# Altium project Tigershark 3D rev2 PreProduction Thermistors Version.PrjPcb (part 1 of 2)
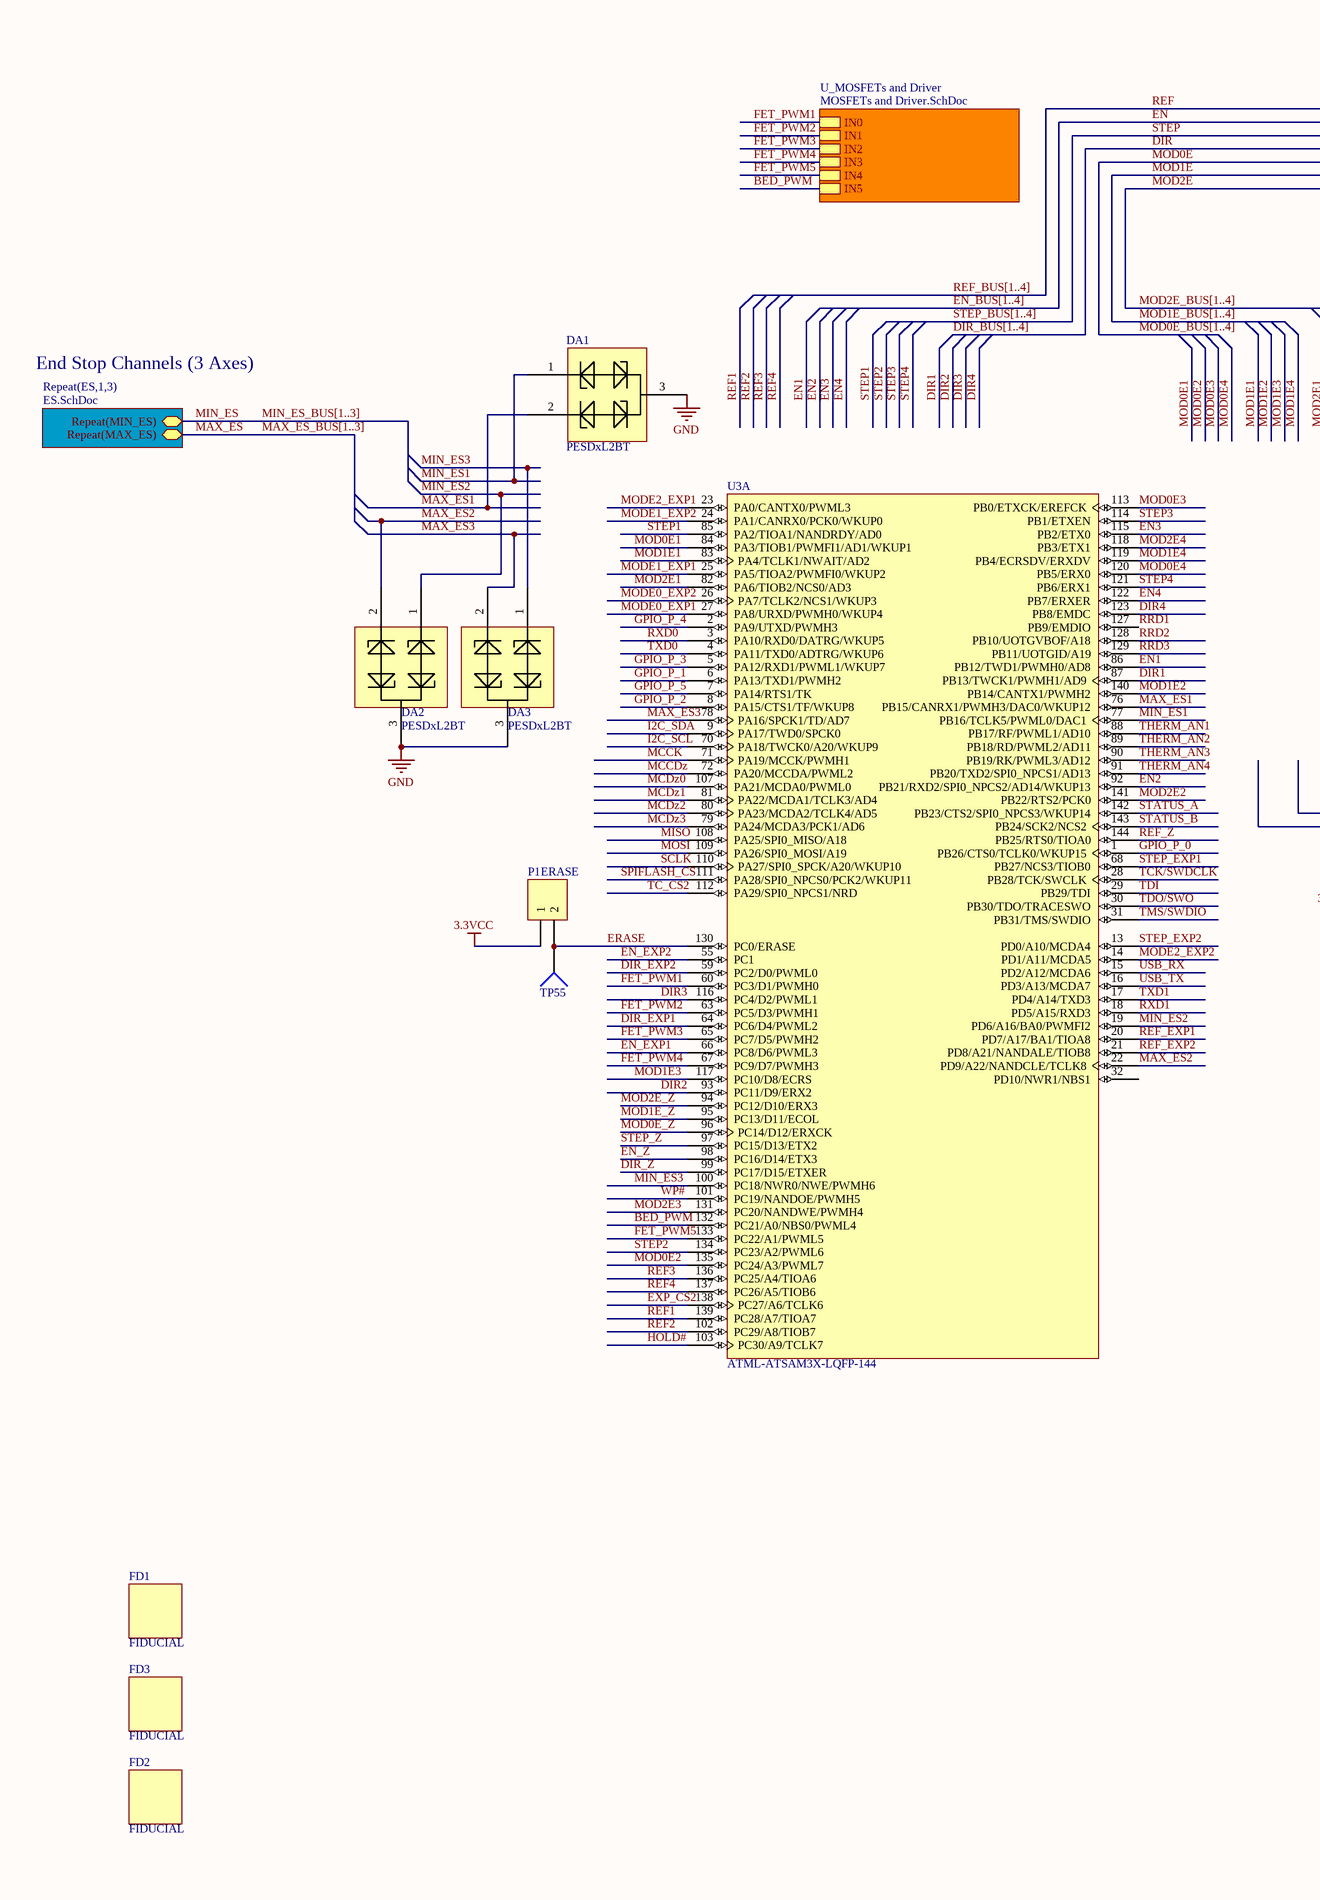
[diagram p0: ATSAM3X8E Main Controller - TR R1.1.SchDoc, left]
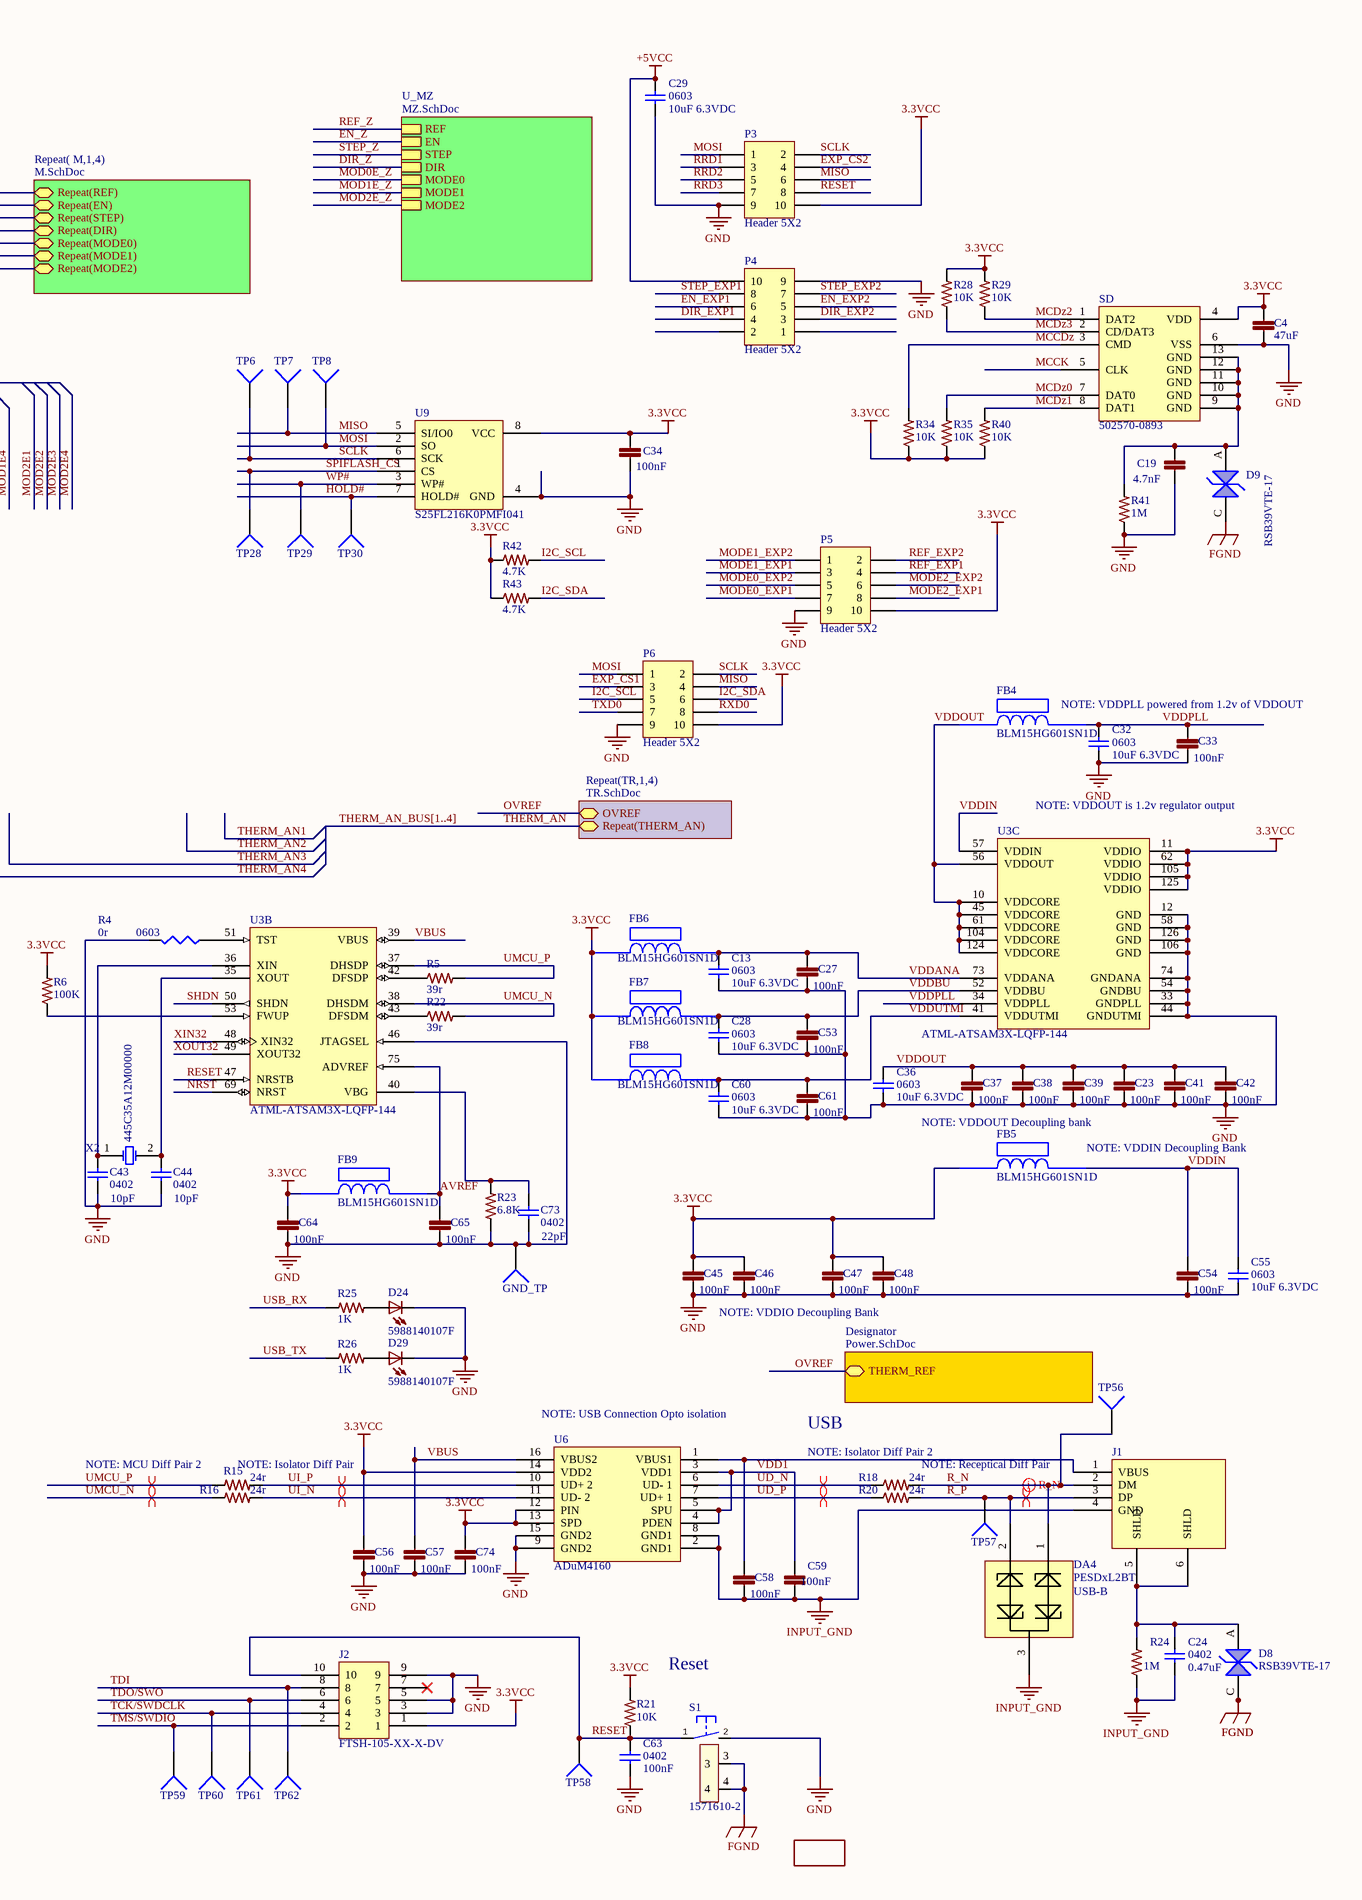
[diagram p1: ATSAM3X8E Main Controller - TR R1.1.SchDoc, right]
7 sheets, 425 parts. Net scope: hierarchical (ports join the sheet entries above them; power ports are global).
Board file: Tigershark 3D R2.4 - TR.PcbDoc
Sheets:
  ATSAM3X8E Main Controller - TR R1.1.SchDoc
    TR1 = TR.SchDoc
    TR2 = TR.SchDoc
    TR3 = TR.SchDoc
    TR4 = TR.SchDoc
    Designator = Power.SchDoc
    ES1 = ES.SchDoc
    ES2 = ES.SchDoc
    ES3 = ES.SchDoc
    M1 = M.SchDoc
    M2 = M.SchDoc
    M3 = M.SchDoc
    M4 = M.SchDoc
    U_MOSFETs and Driver = MOSFETs and Driver.SchDoc
    U_MZ = MZ.SchDoc

## Sheet ATSAM3X8E Main Controller - TR R1.1.SchDoc
size C

### Parts
C4  47uF  [C0805]
C13  0603  value 10uF 6.3VDC  [C0603]
C19  4.7nF  [C0402]
C23  100nF  [C0402]
C24  value 0.47uF  [C0402]  (hidden comment: 0402)
C27  100nF  [C0402]
C28  0603  value 10uF 6.3VDC  [C0603]
C29  0603  value 10uF 6.3VDC  [C0603]
C32  0603  value 10uF 6.3VDC  [C0603]
C33  100nF  [C0402]
C34  100nF  [C0402]
C36  0603  value 10uF 6.3VDC  [C0603]
C37  100nF  [C0402]
C38  100nF  [C0402]
C39  100nF  [C0402]
C41  100nF  [C0402]
C42  100nF  [C0402]
C43  0402  value 10pF  [C0402]
C44  0402  value 10pF  [C0402]
C45  100nF  [C0402]
C46  100nF  [C0402]
C47  100nF  [C0402]
C48  100nF  [C0402]
C53  100nF  [C0402]
C54  100nF  [C0402]
C55  0603  value 10uF 6.3VDC  [C0603]
C56  100nF  [C0402]
C57  100nF  [C0402]
C58  100nF  [C0402]
C59  100nF  [C0402]
C60  0603  value 10uF 6.3VDC  [C0603]
C61  100nF  [C0402]
C63  value 100nF  [C0402]  (hidden comment: 0402)
C64  100nF  [C0402]
C65  100nF  [C0402]
C73  0402  value 22pF  [C0402]
C74  100nF  [C0402]
D8  RSB39VTE-17  [SOD323-R]
D9  RSB39VTE-17  [SOD323-R]
D24  5988140107F  [LED2012120]
D29  5988140107F  [LED2012120]
DA1  PESDxL2BT  [SOT95P230X110-3N]
DA2  PESDxL2BT  [SOT95P230X110-3N]
DA3  PESDxL2BT  [SOT95P230X110-3N]
DA4  PESDxL2BT  [SOT95P230X110-3N]
FB4  BLM15HG601SN1D  [BLM18PG121SN1D]
FB5  BLM15HG601SN1D  [BLM18PG121SN1D]
FB6  BLM15HG601SN1D  [BLM18PG121SN1D]
FB7  BLM15HG601SN1D  [BLM18PG121SN1D]
FB8  BLM15HG601SN1D  [BLM18PG121SN1D]
FB9  BLM15HG601SN1D  [BLM18PG121SN1D]
FD1  FIDUCIAL  [FIDUCIAL-1X2]
FD2  FIDUCIAL  [FIDUCIAL-1X2]
FD3  FIDUCIAL  [FIDUCIAL-1X2]
GND_TP  TP4  [TP-2]  (value not drawn)
J1  USB-B  [PN61729]
J2  FTSH-105-XX-X-DV  [FTSH-105-XX-X-DV]
LOGO1  OSHW_LOGO_8MILX0150-NT  [OSHW_8X150_NOTEXT]  (value not drawn)
P1  ERASE  [HDR1X2]
P3  Header 5X2  [HDR2X5]
P4  Header 5X2  [HDR2X5]
P5  Header 5X2  [HDR2X5]
P6  Header 5X2  [HDR2X5]
R4  0603  value 0r  [J1-0603]
R5  39r  [R0402]
R6  100K  [R0603]
R15  24r  [R0603]
R16  24r  [R0603]
R18  24r  [R0603]
R20  24r  [R0603]
R21  10K  [R0603]
R22  39r  [R0402]
R23  6.8K  [R0402]
R24  1M  [R0402]
R25  1K  [R0603]
R26  1K  [R0603]
R28  10K  [R0603]
R29  10K  [R0603]
R34  10K  [R0603]
R35  10K  [R0603]
R40  10K  [R0603]
R41  1M  [R0402]
R42  4.7K  [R0603]
R43  4.7K  [R0603]
S1  1571610-2  [B3F-31XX]
SD  502570-0893  [502570-0893 - Molex SD]
TP6  TP4  [TP-2]  (value not drawn)
TP7  TP4  [TP-2]  (value not drawn)
TP8  TP4  [TP-2]  (value not drawn)
TP28  TP4  [TP-2]  (value not drawn)
TP29  TP4  [TP-2]  (value not drawn)
TP30  TP4  [TP-2]  (value not drawn)
TP55  TP4  [TP-2]  (value not drawn)
TP56  TP4  [TP-2]  (value not drawn)
TP57  TP4  [TP-2]  (value not drawn)
TP58  TP4  [TP-2]  (value not drawn)
TP59  TP4  [TP-2]  (value not drawn)
TP60  TP4  [TP-2]  (value not drawn)
TP61  TP4  [TP-2]  (value not drawn)
TP62  TP4  [TP-2]  (value not drawn)
U3  ATML-ATSAM3X-LQFP-144  [LQFP144_N]  (parts A,B,C of 3)
U6  ADuM4160  [ADuM4160]
U9  S25FL216K0PMFI041  [S25FL216K0PMFI041]
X2  445C35A12M00000  [445C35A12M00000]

### Sub-sheets
Designator = Power.SchDoc: THERM_REF
Repeat( M,1,4) = M.SchDoc: Repeat(REF), Repeat(EN), Repeat(STEP), Repeat(DIR), Repeat(MODE0), Repeat(MODE1), Repeat(MODE2)
Repeat(ES,1,3) = ES.SchDoc: Repeat(MAX_ES), Repeat(MIN_ES)
Repeat(TR,1,4) = TR.SchDoc: OVREF, Repeat(THERM_AN)
U_MOSFETs and Driver = MOSFETs and Driver.SchDoc: IN0, IN1, IN2, IN3, IN4, IN5
U_MZ = MZ.SchDoc: REF, EN, STEP, DIR, MODE0, MODE1, MODE2

### Nets
3.3VCC: C4.1 C34.1 C45.1 C46.1 C47.1 C48.1 C56.1 C64.1 C74.1 FB5.1 FB6.1 FB7.1 FB8.1 FB9.1 J2.1 P1.1 P3.10 P5.10 P6.10 R6.2 R21.2 R28.2 R29.2 R34.1 R35.1 R40.1 R42.1 R43.1 SD.4(VDD) U3.11(VDDIO) U3.62(VDDIO) U3.105(VDDIO) U3.125(VDDIO) U6.12(PIN) U6.13(SPD) U6.14(VDD2) U9.8(VCC)
+5VCC: C29.2 P4.10
FGND: D8.C D9.C S1.3 S1.4
GND: C4.2 C13.1 C19.2 C23.2 C27.2 C28.1 C29.1 C32.1 C33.2 C34.2 C36.1 C37.2 C38.2 C39.2 C41.2 C42.2 C43.1 C44.1 C45.2 C46.2 C47.2 C48.2 C53.2 C54.2 C55.1 C56.2 C57.2 C60.1 C61.2 C63.1 C64.2 C65.2 C73.1 C74.2 D24.C D29.C DA1.3 DA2.3 DA3.3 GND_TP.1 J2.3 J2.5 J2.9 P3.9 P4.9 P5.9 P6.9 R4.2 R23.1 R41.1 S1.2(S) SD.6(VSS) U3.12(GND) U3.33(GNDPLL) U3.44(GNDUTMI) U3.46(JTAGSEL) U3.54(GNDBU) U3.58(GND) U3.74(GNDANA) U3.106(GND) U3.126(GND) U6.9(GND2) U6.15(GND2) U9.4(GND)
INPUT_GND: C24.1 C58.2 C59.2 DA4.3 J1.4(GND) R24.1 U6.2(GND1) U6.8(GND1)
AVREF: C65.1 FB9.2 U3.75(ADVREF)
BED_PWM: U3.132(PC21/A0/NBS0/PWML4) ; sheet U_MOSFETs and Driver/IN5
DIR: sheet Repeat( M,1,4)/Repeat(DIR)
DIR1: U3.87(PB13/TWCK1/PWMH1/AD9)
DIR2: U3.93(PC11/D9/ERX2)
DIR3: U3.116(PC4/D2/PWML1)
DIR4: U3.123(PB8/EMDC)
DIR_EXP1: P4.4 U3.64(PC6/D4/PWML2)
DIR_EXP2: P4.3 U3.59(PC2/D0/PWML0)
DIR_Z: U3.99(PC17/D15/ETXER) ; sheet U_MZ/DIR
EN: sheet Repeat( M,1,4)/Repeat(EN)
EN1: U3.86(PB12/TWD1/PWMH0/AD8)
EN2: U3.92(PB21/RXD2/SPI0_NPCS2/AD14/WKUP13)
EN3: U3.115(PB2/ETX0)
EN4: U3.122(PB7/ERXER)
EN_EXP1: P4.6 U3.66(PC8/D6/PWML3)
EN_EXP2: P4.5 U3.55(PC1)
EN_Z: U3.98(PC16/D14/ETX3) ; sheet U_MZ/EN
ERASE: P1.2 TP55.1 U3.130(PC0/ERASE)
EXP_CS1: P6.3
EXP_CS2: P3.4 U3.138(PC27/A6/TCLK6)
FET_PWM1: U3.60(PC3/D1/PWMH0) ; sheet U_MOSFETs and Driver/IN0
FET_PWM2: U3.63(PC5/D3/PWMH1) ; sheet U_MOSFETs and Driver/IN1
FET_PWM3: U3.65(PC7/D5/PWMH2) ; sheet U_MOSFETs and Driver/IN2
FET_PWM4: U3.67(PC9/D7/PWMH3) ; sheet U_MOSFETs and Driver/IN3
FET_PWM5: U3.133(PC22/A1/PWML5) ; sheet U_MOSFETs and Driver/IN4
GPIO_P_0: U3.1(PB26/CTS0/TCLK0/WKUP15)
GPIO_P_1: U3.6(PA13/TXD1/PWMH2)
GPIO_P_2: U3.8(PA15/CTS1/TF/WKUP8)
GPIO_P_3: U3.5(PA12/RXD1/PWML1/WKUP7)
GPIO_P_4: U3.2(PA9/UTXD/PWMH3)
GPIO_P_5: U3.7(PA14/RTS1/TK)
HOLD#: TP30.1 U3.103(PC30/A9/TCLK7) U9.7(HOLD#)
I2C_SCL: P6.5 R42.2 U3.70(PA18/TWCK0/A20/WKUP9)
I2C_SDA: P6.6 R43.2 U3.9(PA17/TWD0/SPCK0)
MAX_ES: sheet Repeat(ES,1,3)/Repeat(MAX_ES)
MAX_ES1: DA1.2 U3.76(PB15/CANRX1/PWMH3/DAC0/WKUP12)
MAX_ES2: DA2.2 U3.22(PD9/A22/NANDCLE/TCLK8)
MAX_ES3: DA3.2 U3.78(PA16/SPCK1/TD/AD7)
MCCDz: R34.2 SD.3(CMD) U3.72(PA20/MCCDA/PWML2)
MCCK: SD.5(CLK) U3.71(PA19/MCCK/PWMH1)
MCDz0: R35.2 SD.7(DAT0) U3.107(PA21/MCDA0/PWML0)
MCDz1: R40.2 SD.8(DAT1) U3.81(PA22/MCDA1/TCLK3/AD4)
MCDz2: R29.1 SD.1(DAT2) U3.80(PA23/MCDA2/TCLK4/AD5)
MCDz3: R28.1 SD.2(CD/DAT3) U3.79(PA24/MCDA3/PCK1/AD6)
MIN_ES: sheet Repeat(ES,1,3)/Repeat(MIN_ES)
MIN_ES1: DA1.1 U3.77(PB16/TCLK5/PWML0/DAC1)
MIN_ES2: DA2.1 U3.19(PD6/A16/BA0/PWMFI2)
MIN_ES3: DA3.1 U3.100(PC18/NWR0/NWE/PWMH6)
MISO: P3.6 P6.4 TP7.1 U3.108(PA25/SPI0_MISO/A18) U9.5(SI/IO0)
MOD0E: sheet Repeat( M,1,4)/Repeat(MODE0)
MOD0E1: U3.84(PA3/TIOB1/PWMFI1/AD1/WKUP1)
MOD0E2: U3.135(PC24/A3/PWML7)
MOD0E3: U3.113(PB0/ETXCK/EREFCK)
MOD0E4: U3.120(PB5/ERX0)
MOD0E_Z: U3.96(PC14/D12/ERXCK) ; sheet U_MZ/MODE0
MOD1E: sheet Repeat( M,1,4)/Repeat(MODE1)
MOD1E1: U3.83(PA4/TCLK1/NWAIT/AD2)
MOD1E2: U3.140(PB14/CANTX1/PWMH2)
MOD1E3: U3.117(PC10/D8/ECRS)
MOD1E4: U3.119(PB4/ECRSDV/ERXDV)
MOD1E_Z: U3.95(PC13/D11/ECOL) ; sheet U_MZ/MODE1
MOD2E: sheet Repeat( M,1,4)/Repeat(MODE2)
MOD2E1: U3.82(PA6/TIOB2/NCS0/AD3)
MOD2E2: U3.141(PB22/RTS2/PCK0)
MOD2E3: U3.131(PC20/NANDWE/PWMH4)
MOD2E4: U3.118(PB3/ETX1)
MOD2E_Z: U3.94(PC12/D10/ERX3) ; sheet U_MZ/MODE2
MODE0_EXP1: P5.7 U3.27(PA8/URXD/PWMH0/WKUP4)
MODE0_EXP2: P5.5 U3.26(PA7/TCLK2/NCS1/WKUP3)
MODE1_EXP1: P5.3 U3.25(PA5/TIOA2/PWMFI0/WKUP2)
MODE1_EXP2: P5.1 U3.24(PA1/CANRX0/PCK0/WKUP0)
MODE2_EXP1: P5.8 U3.23(PA0/CANTX0/PWML3)
MODE2_EXP2: P5.6 U3.14(PD1/A11/MCDA5)
MOSI: P3.1 P6.1 TP8.1 U3.109(PA26/SPI0_MOSI/A19) U9.2(SO)
NRST: U3.69(NRST)
OVREF: sheet Repeat(TR,1,4)/OVREF, sheet Designator/THERM_REF
R_N: DA4.1 J1.2(DM) R18.2 TP56.1
R_P: DA4.2 J1.3(DP) R20.2 TP57.1
REF: sheet Repeat( M,1,4)/Repeat(REF)
REF1: U3.139(PC28/A7/TIOA7)
REF2: U3.102(PC29/A8/TIOB7)
REF3: U3.136(PC25/A4/TIOA6)
REF4: U3.137(PC26/A5/TIOB6)
REF_EXP1: P5.4 U3.20(PD7/A17/BA1/TIOA8)
REF_EXP2: P5.2 U3.21(PD8/A21/NANDALE/TIOB8)
REF_Z: U3.144(PB25/RTS0/TIOA0) ; sheet U_MZ/REF
RESET: C63.2 J2.10 P3.8 R21.1 S1.1(P) TP58.1 U3.47(NRSTB)
RRD1: P3.3 U3.127(PB9/EMDIO)
RRD2: P3.5 U3.128(PB10/UOTGVBOF/A18)
RRD3: P3.7 U3.129(PB11/UOTGID/A19)
RXD0: P6.8 U3.3(PA10/RXD0/DATRG/WKUP5)
RXD1: U3.18(PD5/A15/RXD3)
SCLK: P3.2 P6.2 TP6.1 U3.110(PA27/SPI0_SPCK/A20/WKUP10) U9.6(SCK)
SHDN: U3.50(SHDN)
SPIFLASH_CS: TP28.1 U3.111(PA28/SPI0_NPCS0/PCK2/WKUP11) U9.1(CS)
STATUS_A: U3.142(PB23/CTS2/SPI0_NPCS3/WKUP14)
STATUS_B: U3.143(PB24/SCK2/NCS2)
STEP: sheet Repeat( M,1,4)/Repeat(STEP)
STEP1: U3.85(PA2/TIOA1/NANDRDY/AD0)
STEP2: U3.134(PC23/A2/PWML6)
STEP3: U3.114(PB1/ETXEN)
STEP4: U3.121(PB6/ERX1)
STEP_EXP1: P4.8 U3.68(PB27/NCS3/TIOB0)
STEP_EXP2: P4.7 U3.13(PD0/A10/MCDA4)
STEP_Z: U3.97(PC15/D13/ETX2) ; sheet U_MZ/STEP
TC_CS2: U3.112(PA29/SPI0_NPCS1/NRD)
TCK/SWDCLK: J2.4 TP60.1 U3.28(PB28/TCK/SWCLK)
TDI: J2.8 TP62.1 U3.29(PB29/TDI)
TDO/SWO: J2.6 TP61.1 U3.30(PB30/TDO/TRACESWO)
THERM_AN: sheet Repeat(TR,1,4)/Repeat(THERM_AN)
THERM_AN1: U3.88(PB17/RF/PWML1/AD10)
THERM_AN2: U3.89(PB18/RD/PWML2/AD11)
THERM_AN3: U3.90(PB19/RK/PWML3/AD12)
THERM_AN4: U3.91(PB20/TXD2/SPI0_NPCS1/AD13)
TMS/SWDIO: J2.2 TP59.1 U3.31(PB31/TMS/SWDIO)
TXD0: P6.7 U3.4(PA11/TXD0/ADTRG/WKUP6)
TXD1: U3.17(PD4/A14/TXD3)
UD_N: R18.1 U6.6(UD-_1)
UD_P: R20.1 U6.7(UD+_1)
UI_N: R16.2 U6.11(UD-_2)
UI_P: R15.2 U6.10(UD+_2)
UMCU_N: R16.1 R22.2 U3.38(DHSDM)
UMCU_P: R5.2 R15.1 U3.37(DHSDP)
USB_RX: R25.1 U3.15(PD2/A12/MCDA6)
USB_TX: R26.1 U3.16(PD3/A13/MCDA7)
VBUS: C57.1 U3.39(VBUS) U6.16(VBUS2)
VDD1: C59.1 U6.3(VDD1) U6.4(PDEN) U6.5(SPU)
VDDANA: C13.2 C27.1 FB6.2 U3.73(VDDANA)
VDDBU: C28.2 C53.1 FB7.2 U3.52(VDDBU)
VDDIN: C54.1 C55.2 FB5.2 U3.57(VDDIN)
VDDOUT: C23.1 C36.2 C37.1 C38.1 C39.1 C41.1 C42.1 FB4.1 U3.10(VDDCORE) U3.45(VDDCORE) U3.56(VDDOUT) U3.61(VDDCORE) U3.104(VDDCORE) U3.124(VDDCORE)
VDDPLL: C32.2 C33.1 FB4.2 U3.34(VDDPLL)
VDDUTMI: C60.2 C61.1 FB8.2 U3.41(VDDUTMI)
WP#: TP29.1 U3.101(PC19/NANDOE/PWMH5) U9.3(WP#)
XIN32: U3.48(XIN32)
XOUT32: U3.49(XOUT32)
NetC19_1: C19.1 D9.A R41.2 SD.9(GND) SD.10(GND) SD.11(GND) SD.12(GND) SD.13(GND)
NetC24_2: C24.2 D8.A J1.5(SHLD) J1.6(SHLD) R24.2
NetC43_2: C43.2 U3.36(XIN) X2.1(OSC1)
NetC44_2: C44.2 U3.35(XOUT) X2.2(OSC2)
NetC58_1: C58.1 J1.1(VBUS) U6.1(VBUS1)
NetC73_2: C73.2 R23.2 U3.40(VBG)
NetD24_A: D24.A R25.2
NetD29_A: D29.A R26.2
NetR4_1: R4.1 U3.51(TST)
NetR5_1: R5.1 U3.42(DFSDP)
NetR6_1: R6.1 U3.53(FWUP)
NetR22_1: R22.1 U3.43(DFSDM)

Not connected (* = marked no-connect by the designer): J2 7*; P4 1 2; U3 32(PD10/NWR1/NBS1)

### Buses and harness runs
bus DIR_BUS[1..4]
bus EN_BUS[1..4]
bus MAX_ES_BUS[1..3]
bus MIN_ES_BUS[1..3]
bus MOD0E_BUS[1..4]
bus MOD1E_BUS[1..4]
bus MOD2E_BUS[1..4]
bus REF_BUS[1..4]
bus STEP_BUS[1..4]
bus THERM_AN_BUS[1..4]

### Layout directives
differential pair: R_N, R_P, UD_N, UD_P, UI_N, UI_P, UMCU_N, UMCU_P

### Notes on the sheet
- End Stop Channels (3 Axes)
- NOTE: VDDPLL powered from 1.2v of VDDOUT
- NOTE: VDDOUT is 1.2v regulator output
- NOTE: VDDOUT Decoupling bank
- NOTE: VDDIN Decoupling Bank
- NOTE: VDDIO Decoupling Bank
- (near U6) NOTE: USB Connection Opto isolation
- USB
- NOTE: MCU Diff Pair 2
- (near R15) NOTE: Isolator Diff Pair
- NOTE: Isolator Diff Pair 2
- NOTE: Receptical Diff Pair
- Reset

### Library data of the parts
C4 = CL21A476MQCLRNC: CAP CER 47UF 6.3V 20% X5R 0805; Manufacturer: Samsung; LastRevisionNote: ImportComponents; Published: 10 - may 2015; Publisher: UltiMachine; LastRevisionDate: 10 may 2015; ManufacturerPartNumber: CL21A476MQCLRNC; VALUE: 47uF
C13 C28 C29 C32 C36 C55 C60 = C1608JB0J106K080AB: CAP CER 10UF 6.3V 10% JB 0603; MFR: TDK; Voltage: 6.3VDC; Published: 10 - Dec - 2014; LatestRevisionDate: 10 - Dec - 2014; Component Type: Chip Capacitor; MFR Part #: C1608JB0J106K080AB; Part Description: CAP CER 10UF 6.3V 10% JB 0603; Mounting Type: SMT 0603; Datasheet: http://www.tdk.com/pdf/TDKMLCCCapRange.pdf; Height: 0.9mm; Tolerance: 10%; Digikey #: 445-11185-1-ND; PackageReference: 0402
C19 = CC0402KRX7R8BB472: CAP CER 0402 4.7nF 25V 10% X7R; LastRevisionNote: ImportComponents; Published: 23-Apr-2014; Publisher: UltiMachine; LastRevisionDate: 23-Apr-2014; ManufacturerPartNumber: CC0402KRX7R8BB472; VALUE: 4.7nF
C23 C27 C33 C34 C37-C39 C41 C42 C45-C48 C53 C54 C56-C59 C61 C64 C65 C74 = GRM155R71C104KA88D: CAP CER 0402 100nF 16V 10% X7R; LastRevisionNote: ImportComponents; Published: 23-Apr-2014; Publisher: UltiMachine; LastRevisionDate: 23-Apr-2014; ManufacturerPartNumber: GRM155R71C104KA88D; VALUE: 100nF
C24 = GRM155R60J474KE19D: 0.47uF 6.3v C0402 - GRM155R60J474KE19D; MFR: Murata; Part Description: CAP CER 0.47UF 6.3V 10% X5R 0402; Tolerance: 10%; Voltage: 6.3VDC; Published: 10 - Dec - 2014; LatestRevisionDate: 10 - Dec - 2014; LatestRevisionNote: Ultimachine Footprint Added; Publisher: Ultimachine; Component Type: Chip Capacitor; MFR Part #: GRM155R60J474KE19D; Mounting Type: SMT 0402; Datasheet: http://search.murata.co.jp/Ceramy/image/img/A01X/G101/ENG/GRM155R60J474KE19-01.pdf; Height: 0.5 ±0.05mm; PackageReference: 0402
C43 C44 = CL05C100JB5NNNC: CAP CER 10PF 50V 5% NP0 0402; MFR: Samsung; Tolerance: 10%; Voltage: 50VDC; Published: 10 - Dec - 2014; LatestRevisionDate: 10 - Dec - 2014; LatestRevisionNote: Ultimachine Footprint Added; Publisher: Ultimachine; Component Type: Chip Capacitor; MFR Part #: CL05C100JB5NNNC; Part Description: CAP CER 10PF 50V 5% NP0 0402; Mounting Type: SMT 0402; Datasheet: http://www.samsungsem.com/kr/front/downloadcms.do?path=/kr/support/product-search/mlcc/__icsFiles/afieldfile/2014/11/05&fileName=S_CL05C100JB5NNNC.pdf; Height: 0.55mm; PackageReference: 0402
C63 = 100nF C0402 - GRM155R71C104KA88D: Capacitor (Semiconductor SIM Model); MFR: Murata; Part Description: CAP CER 0.1UF 16V 10% X7R 0402; Tolerance: 10%; Voltage: 16v; Published: 10 - Dec - 2014; LatestRevisionDate: 10 - Dec - 2014; LatestRevisionNote: Ultimachine Footprint Added; Publisher: Ultimachine; Component Type: Chip Capacitor; MFR Part #: GRM155R71C104KA88D; Mounting Type: SMT 0402; Datasheet: http://psearch.murata.com/capacitor/product/GRM155R71C104KA88%23.pdf; Height: 0.5 ±0.05mm; PackageReference: 0402
C73 = CL05C220JB5NNNC: CAP CER 22PF 50V 5% NP0 0402; MFR: Samsung; Tolerance: 10%; Voltage: 50VDC; Published: 10 - Dec - 2014; LatestRevisionDate: 10 - Dec - 2014; LatestRevisionNote: Ultimachine Footprint Added; Publisher: Ultimachine; Component Type: Chip Capacitor; MFR Part #: CL05C220JB5NNNC; Part Description: CAP CER 22PF 50V 5% NP0 0402; Mounting Type: SMT 0402; Datasheet: http://www.samsungsem.com/kr/front/downloadcms.do?path=/kr/support/product-search/mlcc/__icsFiles/afieldfile/2014/11/05&fileName=S_CL05C220JB5NNNC.pdf; Height: 0.55mm; PackageReference: 0402
D8 D9 = RSB39VTE-17: DIODE TVS
D24 D29 = 5988140107F: LED 0805 Yellow; LastRevisionNote: ImportComponents; Published: 23-Apr-2014; Publisher: UltiMachine; LastRevisionDate: 23-Apr-2014; VALUE: 5988140107F
DA1-DA4 = PESDxL2BT: PESDxL2BT TVS Diode Array 2x
GND_TP TP6-TP8 TP28-TP30 TP55-TP62 = Socket: LatestRevisionDate: 17-Jul-2002; LatestRevisionNote: Re-released for DXP Platform.; Publisher: Altium Limited
J2 = ARM Cortex JTAG-DEBUG Header
LOGO1 = OSHW_LOGO_8MILX0150-NT: LastRevisionNote: ImportComponents; Published: 23-Apr-2014; Publisher: UltiMachine; LastRevisionDate: 23-Apr-2014
P1 = Header 2: Header, 2-Pin; LatestRevisionDate: 17-Jul-2002; LatestRevisionNote: Re-released for DXP Platform.; Publisher: Altium Limited
P3-P6 = Header 5X2: Header, 5-Pin, Dual row; LatestRevisionDate: 17-Jul-2002; LatestRevisionNote: Re-released for DXP Platform.; Publisher: Altium Limited
R4 = Res3: Resistor; Published: 8-Jun-2000; LatestRevisionDate: 29-May-2009; LatestRevisionNote: IPC-7351 Footprint Added.; PackageReference: J1-0603; Publisher: Altium Limited; PackageDescription: Chip Resistor
R5 R22 = ERJ-2RKF39R0X: RES SMD 39 OHM 1% 1/10W 0402; Manufacturer: Panasonic; LastRevisionNote: ImportComponents; Published: 23-Apr-2014; Publisher: UltiMachine; LastRevisionDate: 23-Apr-2014; ManufacturerPartNumber: ERJ-2RKF39R0X; Height: 0.4mm; VALUE: 39r
R6 = RC0603FR-07100KL: RES 100K OHM 1/10W 1% 0603 SMD; LastRevisionNote: ImportComponents; Published: 23-Apr-2014; Publisher: UltiMachine; LastRevisionDate: 23-Apr-2014; ManufacturerPartNumber: RC0603FR-07100KL; VALUE: 100K
R15 R16 R18 R20 = RC1608F240CS: RES SMD 24 OHM 1% 1/10W 0603; Manufacturer: Samsung; ManufacturerPartNumber: RC0603FR-07100KL; LastRevisionNote: ImportComponents; Published: 23-Apr-2014; Publisher: UltiMachine; LastRevisionDate: 23-Apr-2014; VALUE: 24r; PDF: http://www.samsungsem.com/global/support/library/product-catalog/__icsFiles/afieldfile/2015/01/12/CHIP_RESISTOR_150112_1.pdf
R21 R28 R29 R34 R35 R40 = ERJ-3EKF1002V: RES 0603 10K 100mW 1%; LastRevisionNote: ImportComponents; Published: 23-Apr-2014; Publisher: UltiMachine; LastRevisionDate: 23-Apr-2014; ManufacturerPartNumber: ERJ-3EKF1002V; VALUE: 10K
R23 = CRCW04026K80FKED: RES SMD 6.8K OHM 1% 1/16W 0402; Manufacturer: Vishay Dale; LastRevisionNote: ImportComponents; Published: 23-Apr-2014; Publisher: UltiMachine; LastRevisionDate: 23-Apr-2014; ManufacturerPartNumber: CRCW04026K80FKED; Height: 0.4mm; VALUE: 6.8K
R24 R41 = ERJ2GEJ105X: RES 0402 1M 100mW 5%; LastRevisionNote: ImportComponents; Published: 23-Apr-2014; Publisher: UltiMachine; LastRevisionDate: 23-Apr-2014; ManufacturerPartNumber: ERJ2GEJ105X; VALUE: 1M
R25 R26 = ERJ-3EKF1001V: RES 0603 1K 100mW 1%; LastRevisionNote: ImportComponents; Published: 23-Apr-2014; Publisher: UltiMachine; LastRevisionDate: 23-Apr-2014; ManufacturerPartNumber: ERJ-3EKF1001V; VALUE: 1K
R42 R43 = ERJ3EKF4701V: RES 0603 4.7K 100mW 1%; LastRevisionNote: ImportComponents; Published: 23-Apr-2014; Publisher: UltiMachine; LastRevisionDate: 23-Apr-2014; ManufacturerPartNumber: ERJ3EKF4701V; VALUE: 4.7K
S1 = 1571610-2_1: SWTCH Momentary Washable; Manufacturer: Omron; Manufacturer: TE; LastRevisionNote: Import; ComponentLink1URL: http://www.te.com/commerce/DocumentDelivery/DDEController?Action=srchrtrv&DocNm=1571610&DocType=Customer+Drawing&DocLang=English; ComponentLink1Description: Datasheet for B3F-31XX; Published: 23-Apr-2014; Publisher: UltiMachine; LastRevisionDate: 23-Apr-2014; ManufacturerPartNumber: 1571610-2; Supplier 1: Mouser; Supplier Part Number 1: 506-1571610-2
SD = 502570-0893: microSD 502570-0893 Molex Part
U6 = ADuM4160: USB Opto Isolator
U9 = S25FL216K0PMFI041: Manufacture: Spansion; Active: Yes; Manufacture Part #: S25FL216K0PMFI041; Mounting Type: SMD; Type: SOIC; Datasheet: http://www.spansion.com/Support/Datasheets/S25FL216K_00.pdf; Digikey Part NUmber: 1274-1052-ND; Price: $0.35
X2 = XTAL: Crystal Oscillator; Published: 8-Jun-2000; LatestRevisionDate: 17-Jul-2002; LatestRevisionNote: Re-released for DXP Platform.; PackageReference: R38; Publisher: Altium Limited; PackageDescription: Crystal, Thru-Hole; 2 Leads; Body 3.1 x 8.2 mm (Dia.xH)

## Sheet TR.SchDoc
size A
Used 4 times, as channels TR1, TR2, TR3, TR4. Parts and nets are listed once, with the designators drawn on the sheet.
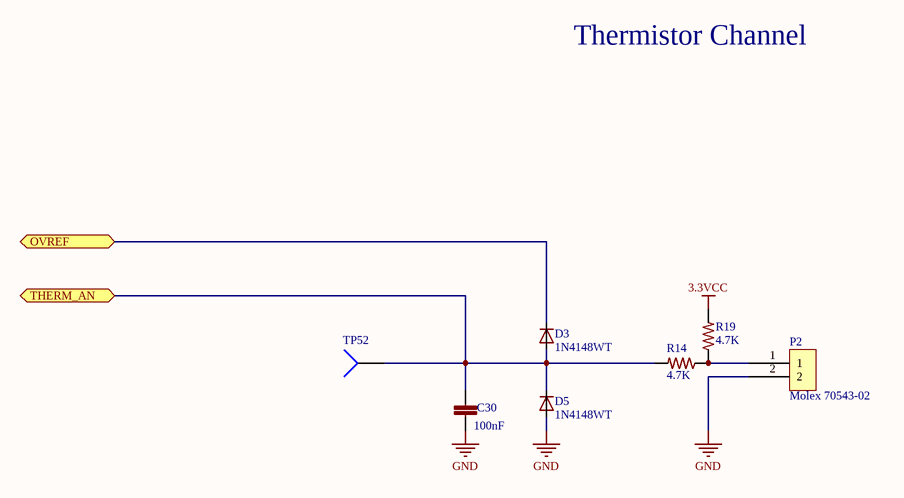
[diagram p2: TR.SchDoc]

### Parts
C30  100nF  [C0402]
D3  1N4148WT  [SOD523]
D5  1N4148WT  [SOD523]
P2  Molex 70543-02  [70543-02]
R14  4.7K  [R0603]
R19  4.7K  [R0603]
TP52  TP4  [TP-2]  (value not drawn)

### Ports
OVREF, THERM_AN

### Nets
3.3VCC: R19.2
GND: C30.2 D5.A P2.2
OVREF: D3.C ; port OVREF
THERM_AN: C30.1 D3.A D5.C R14.2 TP52.1 ; port THERM_AN
NetP2_1: P2.1 R14.1 R19.1

### Channels
TR1: designators end in _TR1; ports OVREF=OVREF THERM_AN=THERM_AN1
TR2: designators end in _TR2; ports OVREF=OVREF THERM_AN=THERM_AN2
TR3: designators end in _TR3; ports OVREF=OVREF THERM_AN=THERM_AN3
TR4: designators end in _TR4; ports OVREF=OVREF THERM_AN=THERM_AN4

### Notes on the sheet
- Thermistor Channel

### Library data of the parts
C30 = GRM155R71C104KA88D: as C23 on sheet ATSAM3X8E Main Controller - TR R1.1; Published: 23-Apr-2014; Publisher: UltiMachine; LastRevisionDate: 23-Apr-2014; ManufacturerPartNumber: GRM155R71C104KA88D; VALUE: 100nF
D3 D5 = 1N4148WT: DIODE SOD523; LastRevisionNote: ImportComponents; Published: 23-Apr-2014; Publisher: UltiMachine; LastRevisionDate: 23-Apr-2014; Value: 1N4148WT
R14 R19 = ERJ3EKF4701V: as R42 on sheet ATSAM3X8E Main Controller - TR R1.1; Published: 23-Apr-2014; Publisher: UltiMachine; LastRevisionDate: 23-Apr-2014; ManufacturerPartNumber: ERJ3EKF4701V; VALUE: 4.7K
TP52 = Socket: LatestRevisionDate: 17-Jul-2002; LatestRevisionNote: Re-released for DXP Platform.; Publisher: Altium Limited

## Sheet Power.SchDoc
size B
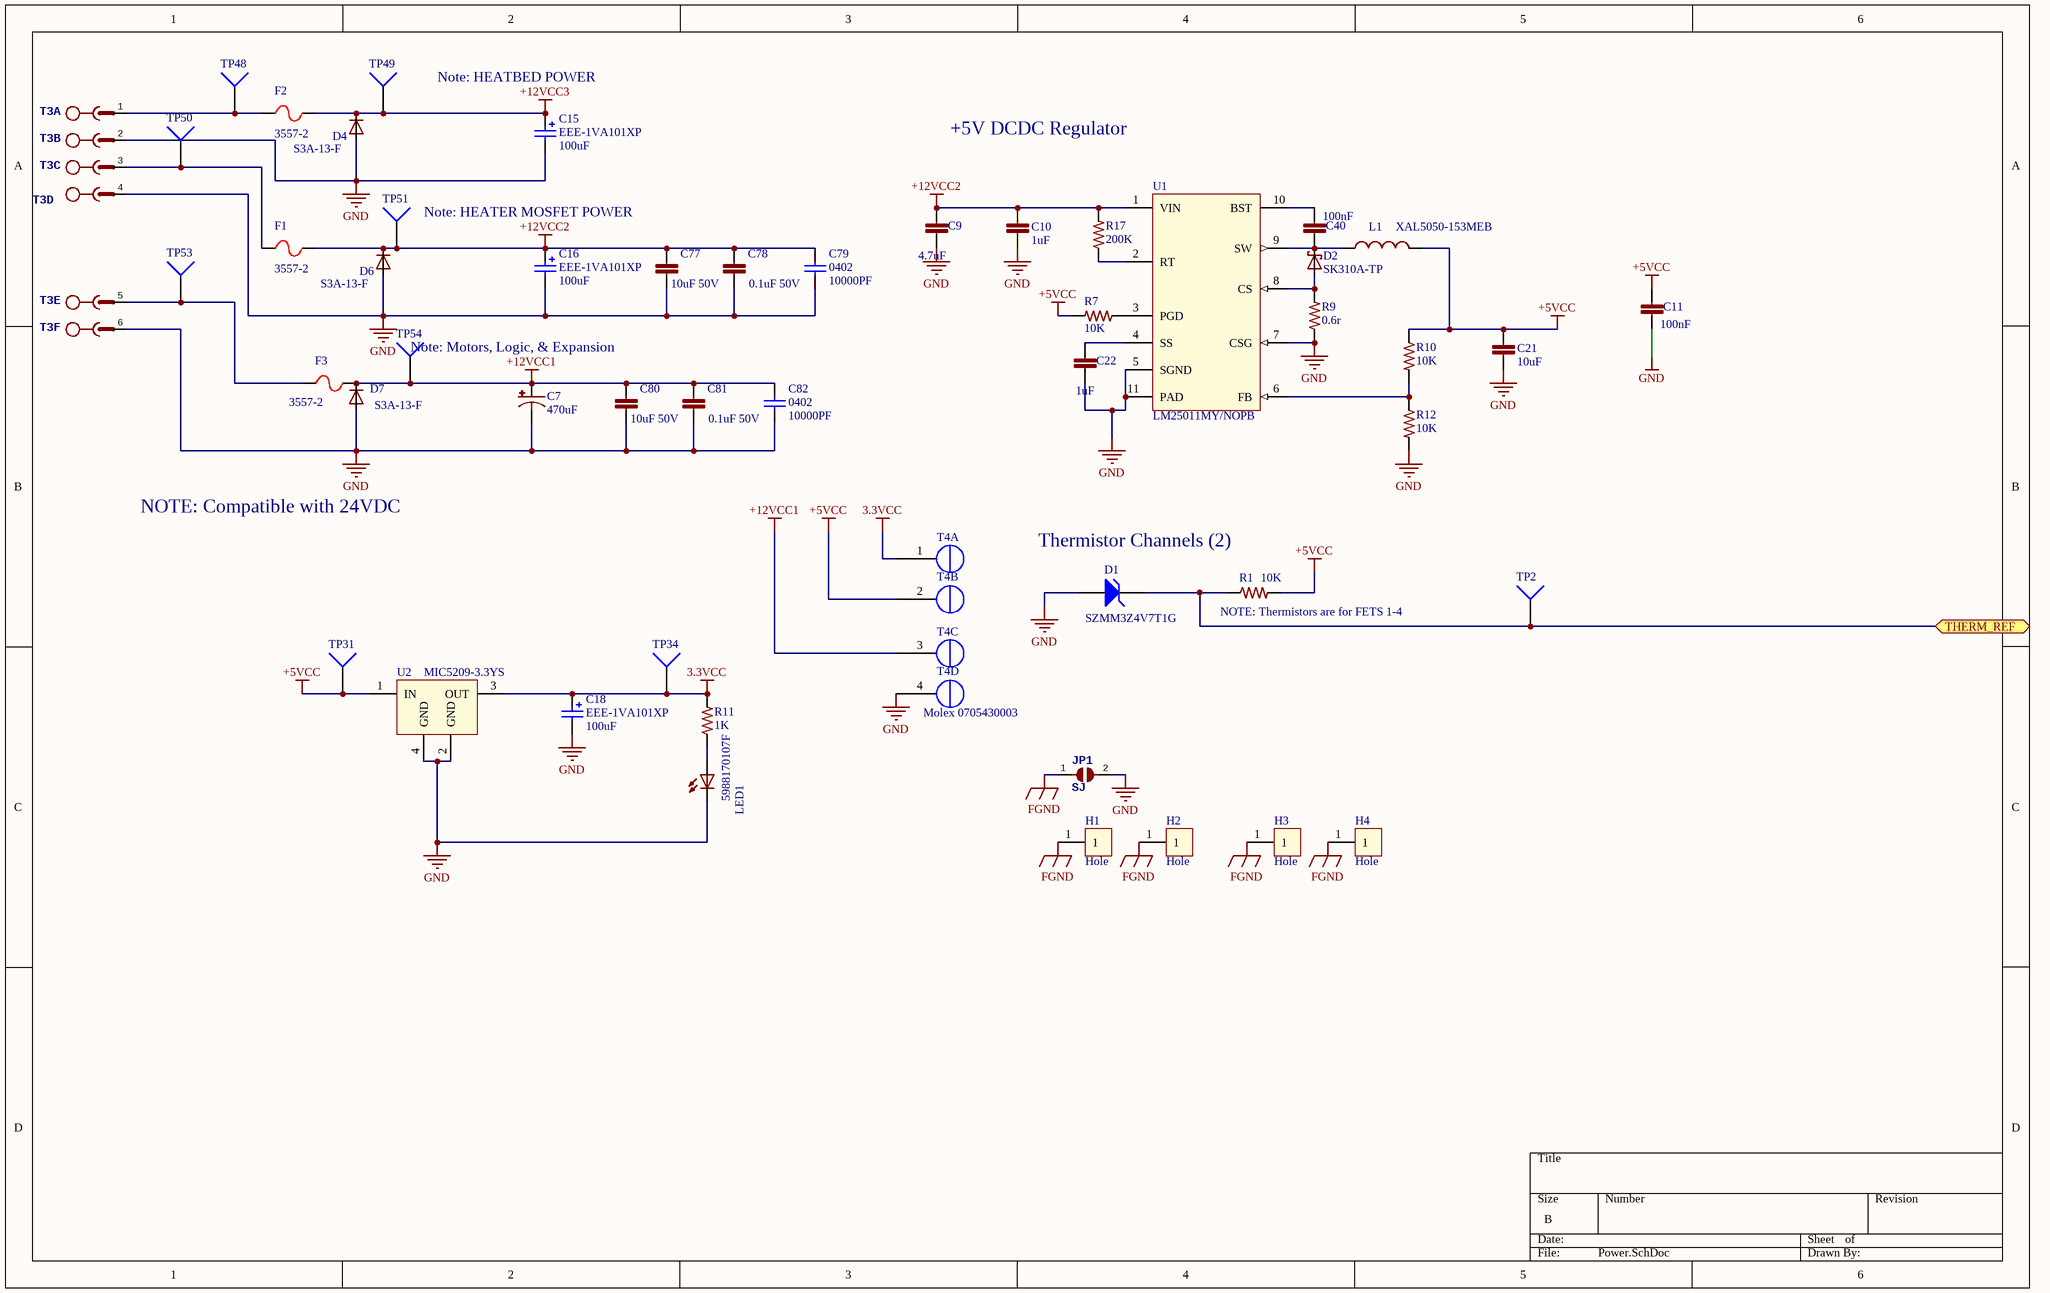
[diagram p3: Power.SchDoc]

### Parts
C7  470uF  [C12,5-5]
C9  4.7uF  [C1206]
C10  1uF  [C0805]
C11  100nF  [C0603]
C15  EEE-1VA101XP  value 100uF  [EEE-1VA101XP]
C16  EEE-1VA101XP  value 100uF  [EEE-1VA101XP]
C18  EEE-1VA101XP  value 100uF  [EEE-1VA101XP]
C21  10uF  [C0805]
C22  1uF  [C0402]
C40  100nF  [C0603]
C77  10uF 50V  [C1206]
C78  0.1uF 50V  [C0603]
C79  value 10000PF  [C0402]  (hidden comment: 0402)
C80  10uF 50V  [C1206]
C81  0.1uF 50V  [C0603]
C82  value 10000PF  [C0402]  (hidden comment: 0402)
D1  SZMM3Z4V7T1G  [SZMM3Z4V7T1G]
D2  SK310A-TP  [SMA-SM]
D4  S3A-13-F  [DO-214AB]
D6  S3A-13-F  [DO-214AB]
D7  S3A-13-F  [DO-214AB]
F1  3557-2  [3557]
F2  3557-2  [3557]
F3  3557-2  [3557]
H1  Hole  [Wave_hole_3x7-singleSided]  (no BOM)
H2  Hole  [Wave_hole_3x7-singleSided]  (no BOM)
H3  Hole  [Wave_hole_3x7-singleSided]  (no BOM)
H4  Hole  [Wave_hole_3x7-singleSided]  (no BOM)
JP1  SJ  [SJ]
L1  XAL5050-153MEB  [XAL50xx-153]
LED1  5988170107F  [LED2012120]
R1  10K  [R0603]
R7  10K  [R0603]
R9  0.6r  [2512R-0.55]
R10  10K  [R0603]
R11  1K  [R0603]
R12  10K  [R0603]
R17  200K  [R0402]
T3  MSTBV6  [MSTBV6]  (value not drawn)  (parts A,B,C,D,E,F of 6)
T4  Molex 0705430003  [4POL254]  (parts A,B,C,D of 4)
TP2  TP4  [TP-2]  (value not drawn)
TP31  TP4  [TP-2]  (value not drawn)
TP34  TP4  [TP-2]  (value not drawn)
TP48  TP4  [TP-2]  (value not drawn)
TP49  TP4  [TP-2]  (value not drawn)
TP50  TP4  [TP-2]  (value not drawn)
TP51  TP4  [TP-2]  (value not drawn)
TP53  TP4  [TP-2]  (value not drawn)
TP54  TP4  [TP-2]  (value not drawn)
U1  LM25011MY/NOPB  [VSSOP10]
U2  MIC5209-3.3YS  [SOT230P700X190-4N]

### Ports
THERM_REF

### Nets
3.3VCC: C18.1 R11.2 T4.1(OUT2B) TP34.1 U2.3(OUT)
+5VCC: C11.1 C21.1 L1.2 R1.2 R7.2 R10.1 T4.2(OUT2A) TP31.1 U2.1(IN)
+12VCC1: C7.1(+) C80.1 C81.1 C82.2 D7.C F3.2 T4.3(OUT1A) TP54.1
+12VCC2: C9.1 C10.1 C16.1 C77.1 C78.1 C79.2 D6.C F1.2 R17.2 TP51.1 U1.1(VIN)
+12VCC3: C15.1 D4.C F2.2 TP49.1
FGND: H1.1 H2.1 H3.1 H4.1 JP1.1
GND: C7.2(-) C9.2 C10.2 C11.2 C15.2 C16.2 C18.2 C21.2 C22.2 C77.2 C78.2 C79.1 C80.2 C81.2 C82.1 D1.1(A) D4.A D6.A D7.A JP1.2 LED1.C R9.1 R12.2 T3.2 T3.4 T3.6 T4.4(OUT1B) U1.5(SGND) U1.7(CSG) U1.11(PAD) U2.2(GND) U2.4(GND)
OVREF: D1.2(K) R1.1 TP2.1 ; port THERM_REF
NetC22_1: C22.1 U1.4(SS)
NetC40_1: C40.1 U1.10(BST)
NetC40_2: C40.2 D2.C L1.1 U1.9(SW)
NetD2_A: D2.A R9.2 U1.8(CS)
NetF1_1: F1.1 T3.3 TP50.1
NetF2_1: F2.1 T3.1 TP48.1
NetF3_1: F3.1 T3.5 TP53.1
NetLED1_A: LED1.A R11.1
NetR7_1: R7.1 U1.3(PGD)
NetR10_2: R10.2 R12.1 U1.6(FB)
NetR17_1: R17.1 U1.2(RT)

### Notes on the sheet
- Note: HEATBED POWER
- +5V DCDC Regulator
- Note: HEATER MOSFET POWER
- (near TP54) Note: Motors, Logic, & Expansion
- NOTE: Compatible with 24VDC
- Thermistor Channels (2)
- (near R1) NOTE: Thermistors are for FETS 1-4

### Library data of the parts
C7 = UPW1H471MHD1TO: CAP ALU 470uF 50V 20%; LastRevisionNote: ImportComponents; Published: 23-Apr-2014; Publisher: UltiMachine; LastRevisionDate: 23-Apr-2014; ManufacturerPartNumber: UPW1H471MHD1TO; VALUE: 470uF
C9 = C1206C475K5PACTU: CAP CER 1206 4.7uF 50V 10% X5R; LastRevisionNote: ImportComponents; Published: 23-Apr-2014; Publisher: UltiMachine; LastRevisionDate: 23-Apr-2014; ManufacturerPartNumber: C1206C475K5PACTU; VALUE: 4.7uF
C10 = GRM21BR71H105KA12L: CAP CER 0805 1uF 50V 10% X7R; LastRevisionNote: ImportComponents; Published: 23-Apr-2014; Publisher: UltiMachine; LastRevisionDate: 23-Apr-2014; ManufacturerPartNumber: GRM21BR71H105KA12L; VALUE: 1uF
C11 C40 = C0603C104K5RACTU: CAP CER 0603 100nF 50V 10% X7R; LastRevisionNote: ImportComponents; LastRevisionDate: 23-Apr-2014; ManufacturerPartNumber: C0603C104K5RACTU; Published: 23-Apr-2014; Publisher: UltiMachine; VALUE: 100nF
C15 C16 C18 = EEE-1VA101XP: CAP ALUM 100UF 35V 20% SMD; Manufacture: Panasonic; Digikey Part #: PCE3951CT-ND; Price: $0.63; Mount Type: SMT Panasonic VS D Series; Status: Active; Height: 7.70mm; Datasheet: http://industrial.panasonic.com/www-cgi/jvcr13pz.cgi?E+PZ+3+ABA0002+EEE1VA101XP+7+WW; Manufacture Part #: EEE-1VA101XP
C21 = C0805C106K8PACTU: CAP CER 0805 10uF 10V 10% X5R; LastRevisionNote: ImportComponents; Published: 23-Apr-2014; Publisher: UltiMachine; LastRevisionDate: 23-Apr-2014; ManufacturerPartNumber: C0805C106K8PACTU; VALUE: 10uF
C22 = GRM155R60J105KE19D: CAP CER 0402 1uF 6.3V 10% X5R; LastRevisionNote: ImportComponents; Published: 23-Apr-2014; Publisher: UltiMachine; LastRevisionDate: 23-Apr-2014; ManufacturerPartNumber: GRM155R60J105KE19D; VALUE: 1uF
C77 C80 = CL31A106KBHNNNE: CAP CER 10UF 50V 10% X5R 1206; Manufacturer: Samsung; LastRevisionNote: ImportComponents; Published: 25-mar-2015; Publisher: UltiMachine; LastRevisionDate: 25-mar-2015; ManufacturerPartNumber: CL31A106KBHNNNE; VALUE: 10uF 50V
C78 C81 = CL10B104KB8SFNC: CAP CER 0.1UF 50V 10% X7R 0603; LastRevisionNote: ImportComponents; Published: 23-Apr-2014; Publisher: UltiMachine; LastRevisionDate: 23-Apr-2014; ManufacturerPartNumber: CL10B104KB8SFNC; VALUE: 0.1uF 50V
C79 C82 = CL05B103JB5NNNC: CAP CER 10000PF 50V 5% X7R 0402; Manufacturer: Samsung; Voltage: 16v; Published: 10 - Dec - 2014; LatestRevisionDate: 10 - Dec - 2014; LatestRevisionNote: Ultimachine Footprint Added; Publisher: Ultimachine; Component Type: Chip Capacitor; Manufacture Part #: CL05B103JB5NNNC; Part Description: CAP CER 10000PF 50V 5% X7R 0402; Mounting Type: SMT 0402; Datasheet: https://www.samsungsem.com/kr/front/downloadcms.do?path=/kr/support/product-search/mlcc/__icsFiles/afieldfile/2014/11/05&fileName=S_CL05B103JB5NNNC.pdf; Height: 0.25 ± 0.15mm; Tolerance: 5%; PackageReference: 0402
D1 = D Zener: Zener Diode; Published: 8-Jun-2000; LatestRevisionDate: 17-Jul-2002; LatestRevisionNote: Re-released for DXP Platform.; PackageReference: DIODE-0.7; Publisher: Altium Limited; PackageDescription: Diode, Thru-Hole; 2 Leads; 0.7 in Pin Spacing
D2 = SK310A: DIODE Schottky 3A SMA; LastRevisionNote: ImportComponents; LastRevisionDate: 23-Apr-2014; ManufacturerPartNumber: SK310A; Published: 23-Apr-2014; Publisher: UltiMachine
D4 D6 D7 = S3A-13-F: DIODE DO-214AB; LastRevisionNote: ImportComponents; Published: 23-Apr-2014; Publisher: UltiMachine; LastRevisionDate: 23-Apr-2014; Value: S3A-13-F
F1-F3 = 3557-2: FUSE PTH ATO; LastRevisionNote: ImportComponents; Published: 23-Apr-2014; Publisher: UltiMachine; LastRevisionDate: 23-Apr-2014; ManufacturerPartNumber: 3557-2
JP1 = SJ: SMD solder jumper; LastRevisionNote: ImportComponents; Published: 23-Apr-2014; Publisher: UltiMachine; LastRevisionDate: 23-Apr-2014
L1 = XAL5050-153MEB: IND 15uH 3.9A 20%; LastRevisionNote: ImportComponents; Published: 23-Apr-2014; Publisher: UltiMachine; LastRevisionDate: 23-Apr-2014; ManufacturerPartNumber: XAL5050-153MEB; Value: XAL5050-153MEB
LED1 = 5988170107F: LED 0805 Green; LastRevisionNote: ImportComponents; Published: 23-Apr-2014; Publisher: UltiMachine; LastRevisionDate: 23-Apr-2014; VALUE: 5988170107F
R1 R7 R10 R12 = ERJ-3EKF1002V: as R21 on sheet ATSAM3X8E Main Controller - TR R1.1; Published: 23-Apr-2014; Publisher: UltiMachine; LastRevisionDate: 23-Apr-2014; ManufacturerPartNumber: ERJ-3EKF1002V; VALUE: 10K
R9 = RL2512FK-070R06L: RES 0.06 OHM 1W 1% 2512 SMD; LastRevisionNote: ImportComponents; Published: 23-Apr-2014; Publisher: UltiMachine; LastRevisionDate: 23-Apr-2014; ManufacturerPartNumber: RL2512FK-070R06L; VALUE: 0.6r
R11 = ERJ-3EKF1001V: as R25 on sheet ATSAM3X8E Main Controller - TR R1.1; Published: 23-Apr-2014; Publisher: UltiMachine; LastRevisionDate: 23-Apr-2014; ManufacturerPartNumber: ERJ-3EKF1001V; VALUE: 1K
R17 = CRCW0402200KFKED: RES 0402 22r 63mW 1%; LastRevisionNote: ImportComponents; Published: 23-Apr-2014; Publisher: UltiMachine; LastRevisionDate: 23-Apr-2014; ManufacturerPartNumber: CRCW0402200KFKED; VALUE: 200K
T3 = MSTBV6: PHOENIX; LastRevisionNote: ImportComponents; Published: 23-Apr-2014; Publisher: UltiMachine; LastRevisionDate: 23-Apr-2014
T4 = Molex 0705430003 Alt: Molex 4 Pin Clip Connector
TP2 TP31 TP34 TP48-TP51 TP53 TP54 = Socket: LatestRevisionDate: 17-Jul-2002; LatestRevisionNote: Re-released for DXP Platform.; Publisher: Altium Limited
U1 = LM25011: REG BUCK; Value: LM25011MY/NOPB

## Sheet ES.SchDoc
size A
Used 3 times, as channels ES1, ES2, ES3. Parts and nets are listed once, with the designators drawn on the sheet.
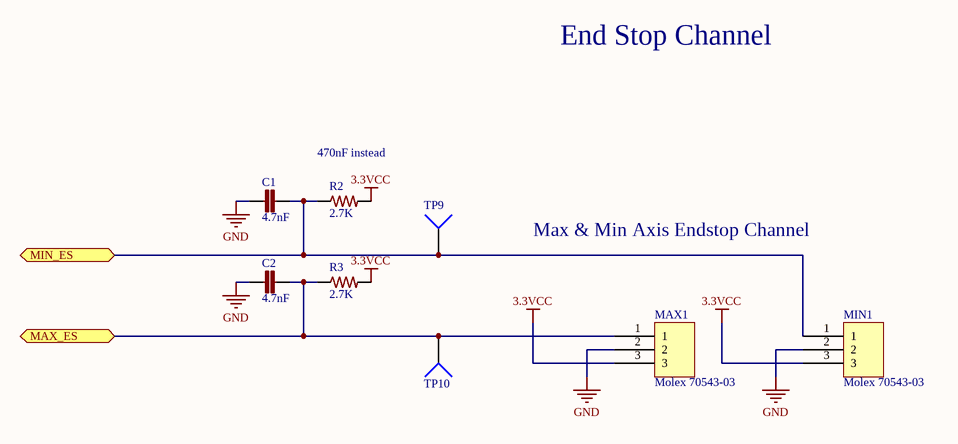
[diagram p4: ES.SchDoc]

### Parts
C1  4.7nF  [C0402]
C2  4.7nF  [C0402]
MAX1  Molex 70543-03  [70543-03]
MIN1  Molex 70543-03  [70543-03]
R2  2.7K  [R0402]
R3  2.7K  [R0402]
TP9  TP4  [TP-2]  (value not drawn)
TP10  TP4  [TP-2]  (value not drawn)

### Ports
MAX_ES, MIN_ES

### Nets
3.3VCC: MAX1.3 MIN1.3 R2.2 R3.2
GND: C1.1 C2.1 MAX1.2 MIN1.2
MAX_ES: C2.2 MAX1.1 R3.1 TP10.1 ; port MAX_ES
MIN_ES: C1.2 MIN1.1 R2.1 TP9.1 ; port MIN_ES

### Channels
ES1: designators end in _ES1; ports MAX_ES=MAX_ES1 MIN_ES=MIN_ES1
ES2: designators end in _ES2; ports MAX_ES=MAX_ES2 MIN_ES=MIN_ES2
ES3: designators end in _ES3; ports MAX_ES=MAX_ES3 MIN_ES=MIN_ES3

### Notes on the sheet
- End Stop Channel
- 470nF instead
- Max & Min Axis Endstop Channel

### Library data of the parts
C1 C2 = CC0402KRX7R8BB472: as C19 on sheet ATSAM3X8E Main Controller - TR R1.1; Published: 23-Apr-2014; Publisher: UltiMachine; LastRevisionDate: 23-Apr-2014; ManufacturerPartNumber: CC0402KRX7R8BB472; VALUE: 4.7nF
MAX1 MIN1 = Molex Endstop
R2 R3 = ERJ-2GEJ272X: RES SMD 2.7K OHM 5% 1/10W 0402; LastRevisionNote: ImportComponents; Published: 23-Apr-2014; Publisher: Adam Vadala-Roth; LastRevisionDate: 23-Apr-2014; ManufacturerPartNumber: ERJ-2GEJ272X; Digikey #: P2.7KJCT-ND; Tolerance: 5%; Mounting type: SMD; VALUE: 2.7K
TP9 TP10 = Socket: LatestRevisionDate: 17-Jul-2002; LatestRevisionNote: Re-released for DXP Platform.; Publisher: Altium Limited

## Sheet M.SchDoc
size A
Used 4 times, as channels M1, M2, M3, M4. Parts and nets are listed once, with the designators drawn on the sheet.
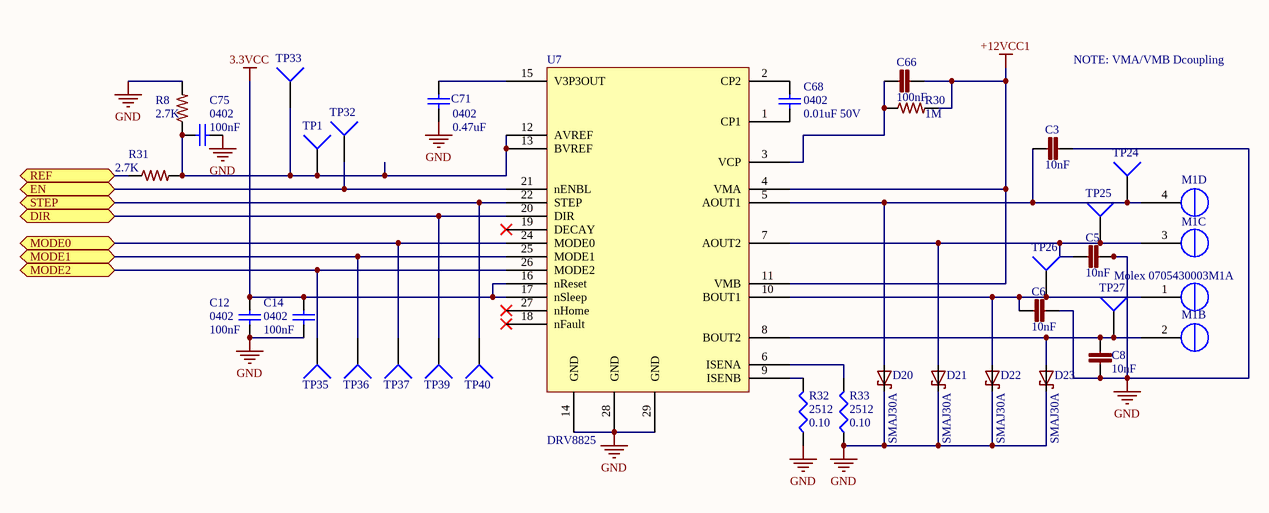
[diagram p5: M.SchDoc]

### Parts
C3  10nF  [C0603]
C5  10nF  [C0603]
C6  10nF  [C0603]
C8  10nF  [C0603]
C12  value 100nF  [C0402]  (hidden comment: 0402)
C14  value 100nF  [C0402]  (hidden comment: 0402)
C66  100nF  [C0603]
C68  value 0.01uF 50V  [C0402]  (hidden comment: 0402)
C71  value 0.47uF  [C0402]  (hidden comment: 0402)
C75  value 100nF  [C0402]  (hidden comment: 0402)
D20  SMAJ30A  [SMA-SM]
D21  SMAJ30A  [SMA-SM]
D22  SMAJ30A  [SMA-SM]
D23  SMAJ30A  [SMA-SM]
M1  Molex 0705430003  [4POL254]  (parts A,B,C,D of 4)
R8  2.7K  [R0402]
R30  1M  [R0402]
R31  2.7K  [R0402]
R32  2512  value 0.10  [2512R-0.55]
R33  2512  value 0.10  [2512R-0.55]
TP1  TP4  [TP-2]  (value not drawn)
TP24  TP4  [TP-2]  (value not drawn)
TP25  TP4  [TP-2]  (value not drawn)
TP26  TP4  [TP-2]  (value not drawn)
TP27  TP4  [TP-2]  (value not drawn)
TP32  TP4  [TP-2]  (value not drawn)
TP33  TP4  [TP-2]  (value not drawn)
TP35  TP4  [TP-2]  (value not drawn)
TP36  TP4  [TP-2]  (value not drawn)
TP37  TP4  [TP-2]  (value not drawn)
TP39  TP4  [TP-2]  (value not drawn)
TP40  TP4  [TP-2]  (value not drawn)
U7  DRV8825  [DRV8825PWPR]

### Ports
DIR, EN, MODE0, MODE1, MODE2, REF, STEP

### Nets
3.3VCC: C12.2 C14.2 U7.16(nReset) U7.17(nSleep)
+12VCC1: C66.2 R30.2 U7.4(VMA) U7.11(VMB)
GND: C3.2 C5.2 C6.2 C8.1 C12.1 C14.1 C71.1 C75.1 D20.C D21.C D22.C D23.C R8.2 R32.1 R33.1 U7.14(GND) U7.28(GND) U7.29(GND)
DIR: TP39.1 U7.20(DIR) ; port DIR
EN: TP32.1 U7.21(nENBL) ; port EN
MODE0: TP37.1 U7.24(MODE0) ; port MODE0
MODE1: TP36.1 U7.25(MODE1) ; port MODE1
MODE2: TP35.1 U7.26(MODE2) ; port MODE2
REF: R31.1 ; port REF
STEP: TP40.1 U7.22(STEP) ; port STEP
NetC3_1: C3.1 D20.A M1.4(OUT1B) TP24.1 U7.5(AOUT1)
NetC5_1: C5.1 D21.A M1.3(OUT1A) TP25.1 U7.7(AOUT2)
NetC6_1: C6.1 D22.A M1.1(OUT2B) TP26.1 U7.10(BOUT1)
NetC8_2: C8.2 D23.A M1.2(OUT2A) TP27.1 U7.8(BOUT2)
NetC66_1: C66.1 R30.1 U7.3(VCP)
NetC68_1: C68.1 U7.1(CP1)
NetC68_2: C68.2 U7.2(CP2)
NetC71_2: C71.2 U7.15(V3P3OUT)
NetC75_2: C75.2 R8.1 R31.2 TP1.1 TP33.1 U7.12(AVREF) U7.13(BVREF)
NetR32_2: R32.2 U7.9(ISENB)
NetR33_2: R33.2 U7.6(ISENA)

Not connected (* = marked no-connect by the designer): U7 18(nFault)* 19(DECAY)* 23(NC) 27(nHome)*

### Channels
M1: designators end in _M1; ports DIR=DIR1 EN=EN1 MODE0=MOD0E1 MODE1=MOD1E1 MODE2=MOD2E1 REF=REF1 STEP=STEP1
M2: designators end in _M2; ports DIR=DIR2 EN=EN2 MODE0=MOD0E2 MODE1=MOD1E2 MODE2=MOD2E2 REF=REF2 STEP=STEP2
M3: designators end in _M3; ports DIR=DIR3 EN=EN3 MODE0=MOD0E3 MODE1=MOD1E3 MODE2=MOD2E3 REF=REF3 STEP=STEP3
M4: designators end in _M4; ports DIR=DIR4 EN=EN4 MODE0=MOD0E4 MODE1=MOD1E4 MODE2=MOD2E4 REF=REF4 STEP=STEP4

### Notes on the sheet
- NOTE: VMA/VMB Dcoupling

### Library data of the parts
C3 C5 C6 C8 = C1608X7R1E103K080AA: CAP CER 0603 10nF 25V 10% X7R; LastRevisionNote: ImportComponents; Published: 23-Apr-2014; Publisher: UltiMachine; LastRevisionDate: 23-Apr-2014; ManufacturerPartNumber: C1608X7R1E103K080AA; VALUE: 10nF
C12 C14 C75 = 100nF C0402 - GRM155R71C104KA88D: as C63 on sheet ATSAM3X8E Main Controller - TR R1.1; Published: 10 - Dec - 2014; LatestRevisionDate: 10 - Dec - 2014; LatestRevisionNote: Ultimachine Footprint Added; Publisher: Ultimachine; Component Type: Chip Capacitor; MFR Part #: GRM155R71C104KA88D; Mounting Type: SMT 0402; Datasheet: http://psearch.murata.com/capacitor/product/GRM155R71C104KA88%23.pdf; Height: 0.5 ±0.05mm; PackageReference: 0402
C66 = C0603C104K5RACTU: as C11 on sheet Power; Published: 23-Apr-2014; Publisher: UltiMachine; LastRevisionDate: 23-Apr-2014; ManufacturerPartNumber: C0603C104K5RACTU; VALUE: 100nF
C68 = GRM155R71H103JA88D: CAP CER 10000PF 50V X7R 0402; MFR: Murata; Tolerance: 10%; Voltage: 6.3VDC; Published: 10 - Dec - 2014; LatestRevisionDate: 10 - Dec - 2014; LatestRevisionNote: Ultimachine Footprint Added; Publisher: Ultimachine; Component Type: Chip Capacitor; MFR Part #: GRM155R71H103JA88D; Part Description: CAP CER 10000PF 50V X7R 0402; Mounting Type: SMT 0402; Datasheet: http://search.murata.co.jp/Ceramy/image/img/A01X/G101/ENG/GRM155R71H103JA88-01.pdf; Height: 0.5 ±0.05mm; Digikey #: 490-7763-1-ND; PackageReference: 0402
C71 = GRM155R60J474KE19D: as C24 on sheet ATSAM3X8E Main Controller - TR R1.1; Published: 10 - Dec - 2014; LatestRevisionDate: 10 - Dec - 2014; LatestRevisionNote: Ultimachine Footprint Added; Publisher: Ultimachine; Component Type: Chip Capacitor; MFR Part #: GRM155R60J474KE19D; Mounting Type: SMT 0402; Datasheet: http://search.murata.co.jp/Ceramy/image/img/A01X/G101/ENG/GRM155R60J474KE19-01.pdf; Height: 0.5 ±0.05mm; PackageReference: 0402
D20-D23 = SMAJ30A: DIODE TVS 30V SMA; LastRevisionNote: ImportComponents; Published: 23-Apr-2014; Publisher: UltiMachine; LastRevisionDate: 23-Apr-2014; ManufacturerPartNumber: SMAJ30A
M1 = Molex 0705430003 Alt: Molex 4 Pin Clip Connector
R8 R31 = ERJ-2RKF2701X: RES SMD 2.7K OHM 1% 1/10W 0402; Manufacturer: Panasonic; ManufacturerPartNumber: ERJ2GEJ105X; LastRevisionNote: ImportComponents; Published: 23-Apr-2014; Publisher: Adam; LastRevisionDate: 23-Apr-2014; VALUE: 2.7K
R30 = ERJ2GEJ105X: as R24 on sheet ATSAM3X8E Main Controller - TR R1.1; Published: 23-Apr-2014; Publisher: UltiMachine; LastRevisionDate: 23-Apr-2014; ManufacturerPartNumber: ERJ2GEJ105X; VALUE: 1M
R32 R33 = CSRN2512FTR100: RES SMD 0.1 OHM 1% 2W 2512; MFR: Stackpole ELectronics Inc; PackageReference: 2512; MFR #: CSRN2512FTR100; Digikey #: CSRN2512FTR100TR-ND; PDF: http://www.seielect.com/catalog/SEI-CSR_CSRN.pdf
TP1 TP24-TP27 TP32 TP33 TP35-TP37 TP39 TP40 = Socket: LatestRevisionDate: 17-Jul-2002; LatestRevisionNote: Re-released for DXP Platform.; Publisher: Altium Limited
U7 = DRV8825: DRV8825 Ti Stepper Driver; Manufacture: Texas Instruments; Mountining Type: SMD - Ti PowerPAD Package; Voltage: 8.2-45VDC; Cost (1000 qty): 2.25; Part Number: DRV8825PWPR; Status: In-Production; Pins: 28 Pins and one Exposed Pad; Datasheet: http://www.ti.com/lit/gpn/drv8825; Height: 1.2mm; Tolerance: N/A; Type: Stepper Driver - Integrated Circuit; Lead Free: YES

## Sheet MOSFETs and Driver.SchDoc
size B
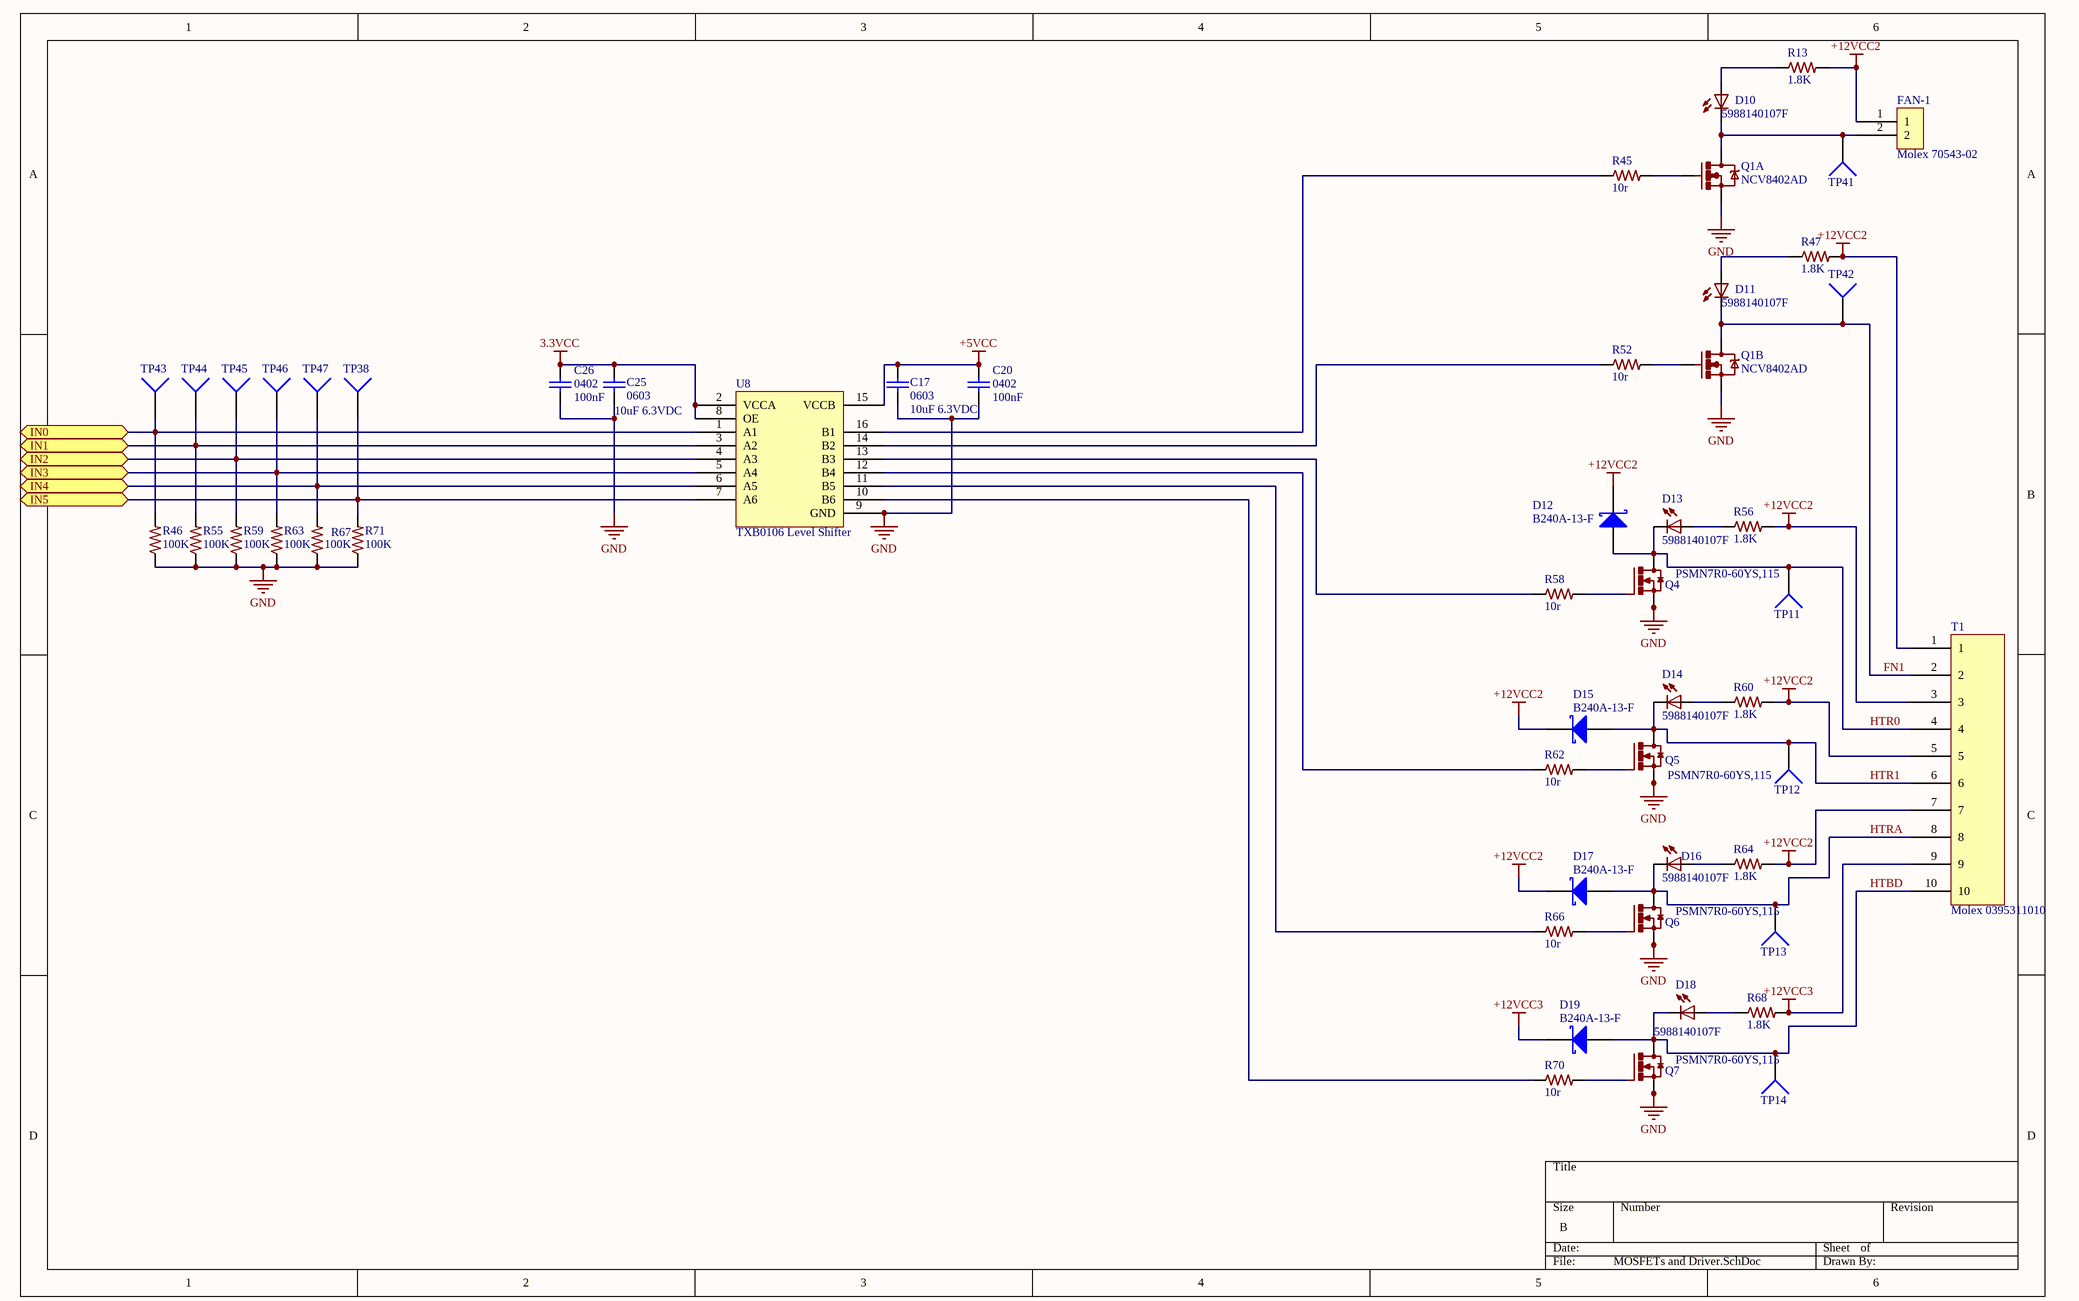
[diagram p6: MOSFETs and Driver.SchDoc]

### Parts
C17  0603  value 10uF 6.3VDC  [C0603]
C20  value 100nF  [C0402]  (hidden comment: 0402)
C25  0603  value 10uF 6.3VDC  [C0603]
C26  value 100nF  [C0402]  (hidden comment: 0402)
D10  5988140107F  [LED2012120]
D11  5988140107F  [LED2012120]
D12  B240A-13-F  [SK310A-TP]
D13  5988140107F  [LED2012120]
D14  5988140107F  [LED2012120]
D15  B240A-13-F  [SK310A-TP]
D16  5988140107F  [LED2012120]
D17  B240A-13-F  [SK310A-TP]
D18  5988140107F  [LED2012120]
D19  B240A-13-F  [SK310A-TP]
FAN-1  Molex 70543-02  [70543-02]
Q1  NCV8402AD  [NCV8402AD-SOIC8]  (parts A,B of 2)
Q4  PSMN7R0-60YS,115  [SOT669]
Q5  PSMN7R0-60YS,115  [SOT669]
Q6  PSMN7R0-60YS,115  [SOT669]
Q7  PSMN7R0-60YS,115  [SOT669]
R13  1.8K  [R0603]
R45  10r  [R0603]
R46  100K  [R0402]
R47  1.8K  [R0603]
R52  10r  [R0603]
R55  100K  [R0402]
R56  1.8K  [R0603]
R58  10r  [R0603]
R59  100K  [R0402]
R60  1.8K  [R0603]
R62  10r  [R0603]
R63  100K  [R0402]
R64  1.8K  [R0603]
R66  10r  [R0603]
R67  100K  [R0402]
R68  1.8K  [R0603]
R70  10r  [R0603]
R71  100K  [R0402]
T1  Molex 0395311010  [MSTBV10]
TP11  TP4  [TP-2]  (value not drawn)
TP12  TP4  [TP-2]  (value not drawn)
TP13  TP4  [TP-2]  (value not drawn)
TP14  TP4  [TP-2]  (value not drawn)
TP38  TP4  [TP-2]  (value not drawn)
TP41  TP4  [TP-2]  (value not drawn)
TP42  TP4  [TP-2]  (value not drawn)
TP43  TP4  [TP-2]  (value not drawn)
TP44  TP4  [TP-2]  (value not drawn)
TP45  TP4  [TP-2]  (value not drawn)
TP46  TP4  [TP-2]  (value not drawn)
TP47  TP4  [TP-2]  (value not drawn)
U8  TXB0106 Level Shifter  [TSOP65P640X120-16N]

### Ports
IN0, IN1, IN2, IN3, IN4, IN5

### Nets
3.3VCC: C25.2 C26.2 U8.2(VCCA) U8.8(OE)
+5VCC: C17.2 C20.2 U8.15(VCCB)
+12VCC2: D12.2(K) D15.2(K) D17.2(K) FAN-1.1 R13.2 R47.2 R56.2 R60.2 R64.2 T1.1 T1.3 T1.5 T1.7
+12VCC3: D19.2(K) R68.2 T1.9
GND: C17.1 C20.1 C25.1 C26.1 Q1.1(S) Q1.3(S) Q4.1(S) Q4.2(S) Q4.3(S) Q5.1(S) Q5.2(S) Q5.3(S) Q6.1(S) Q6.2(S) Q6.3(S) Q7.1(S) Q7.2(S) Q7.3(S) R46.1 R55.1 R59.1 R63.1 R67.1 R71.1 U8.9(GND)
BED_PWM: R71.2 TP38.1 U8.7(A6) ; port IN5
FET_PWM1: R46.2 TP43.1 U8.1(A1) ; port IN0
FET_PWM2: R55.2 TP44.1 U8.3(A2) ; port IN1
FET_PWM3: R59.2 TP45.1 U8.4(A3) ; port IN2
FET_PWM4: R63.2 TP46.1 U8.5(A4) ; port IN3
FET_PWM5: R67.2 TP47.1 U8.6(A5) ; port IN4
FN1: D11.C Q1.5(D) T1.2 TP42.1
HTBD: D18.C D19.1(A) Q7.MB(D) T1.10 TP14.1
HTR0: D12.1(A) D13.C Q4.MB(D) T1.4 TP11.1
HTR1: D14.C D15.1(A) Q5.MB(D) T1.6 TP12.1
HTRA: D16.C D17.1(A) Q6.MB(D) T1.8 TP13.1
NetD10_A: D10.A R13.1
NetD10_C: D10.C FAN-1.2 Q1.7(D) TP41.1
NetD11_A: D11.A R47.1
NetD13_A: D13.A R56.1
NetD14_A: D14.A R60.1
NetD16_A: D16.A R64.1
NetD18_A: D18.A R68.1
NetQ1_2: Q1.2(G) R45.2
NetQ1_4: Q1.4(G) R52.2
NetQ4_4: Q4.4(G) R58.2
NetQ5_4: Q5.4(G) R62.2
NetQ6_4: Q6.4(G) R66.2
NetQ7_4: Q7.4(G) R70.2
NetR45_1: R45.1 U8.16(B1)
NetR52_1: R52.1 U8.14(B2)
NetR58_1: R58.1 U8.13(B3)
NetR62_1: R62.1 U8.12(B4)
NetR66_1: R66.1 U8.11(B5)
NetR70_1: R70.1 U8.10(B6)

### Library data of the parts
C17 C25 = C1608JB0J106K080AB: as C13 on sheet ATSAM3X8E Main Controller - TR R1.1; Published: 10 - Dec - 2014; LatestRevisionDate: 10 - Dec - 2014; Component Type: Chip Capacitor; MFR Part #: C1608JB0J106K080AB; Part Description: CAP CER 10UF 6.3V 10% JB 0603; Mounting Type: SMT 0603; Datasheet: http://www.tdk.com/pdf/TDKMLCCCapRange.pdf; Height: 0.9mm; Tolerance: 10%; Digikey #: 445-11185-1-ND; PackageReference: 0402
C20 C26 = GRM155R71C104KA88D: CAP CER 0.1UF (100nF) 16V 10% X7R 0402; MFR: Murata; Part Description: CAP CER 0.1UF 16V 10% X7R 0402; Published: 10 - Dec - 2014; LatestRevisionDate: 10 - Dec - 2014; LatestRevisionNote: Ultimachine Footprint Added; Publisher: Ultimachine; Component Type: Chip Capacitor; MFR Part #: GRM155R71C104KA88D; Mounting Type: SMT 0402; Datasheet: http://psearch.murata.com/capacitor/product/GRM155R71C104KA88%23.pdf; Height: 0.5 ±0.05mm; Tolerance: 10%; Voltage: 16v; PackageReference: 0402
D10 D11 D13 D14 D16 D18 = 5988140107F: as D24 on sheet ATSAM3X8E Main Controller - TR R1.1; Published: 23-Apr-2014; Publisher: UltiMachine; LastRevisionDate: 23-Apr-2014; VALUE: 5988140107F
D12 D15 D17 D19 = D Schottky: Schottky Diode; Published: 8-Jun-2000; LatestRevisionDate: 17-Jul-2002; LatestRevisionNote: Re-released for DXP Platform.; PackageReference: SMB; Publisher: Altium Limited; PackageDescription: DO-214-AA/SMB; 2 C-Bend Leads; Body 5.3 x 3.6 mm, inc. leads (LxW); Code_JEDEC: DO-214-AA
Q4-Q7 = PSMN7R0-60YS,115: Mosfet N-channel 60V 356A 117W 9.3mOhms; LastRevisionNote: ImportComponents; Published: 23-Apr-2014; Publisher: UltiMachine; LastRevisionDate: 23-Apr-2014; ManufacturerPartNumber: PSMN7R0-60YS,115
R13 R47 R56 R60 R64 R68 = RC0603JR-071K8L: RES 0603 1.8K 100mW 5%; LastRevisionNote: ImportComponents; Published: 23-Apr-2014; Publisher: UltiMachine; LastRevisionDate: 23-Apr-2014; ManufacturerPartNumber: RC0603JR-071K8L; VALUE: 1.8K
R45 R52 R58 R62 R66 R70 = CRCW060310R0FKEA: RES 0603 10r 100mW 1%; LastRevisionNote: ImportComponents; Published: 23-Apr-2014; Publisher: UltiMachine; LastRevisionDate: 23-Apr-2014; ManufacturerPartNumber: CRCW060310R0FKEA; VALUE: 10r
R46 R55 R59 R63 R67 R71 = RC1005F104CS: RES SMD 100K OHM 1% 1/16W 0402; Manufacturer: Samsung; LastRevisionNote: ImportComponents; Digilkey #: 1276-3432-1-ND; Published: 23-Apr-2014; Publisher: UltiMachine; LastRevisionDate: 23-Apr-2014; ManufacturerPartNumber: RC1005F104CS; VALUE: 100K
T1 = 0395311010 - Molex 10 Position Connector: MSBTV10 10 port connector same as RAMBo; Manufacture: Molex; Mounting Type: Through Hole; Part Number: 0395311010; Datasheet: http://www.molex.com/pdm_docs/sd/395311002_sd.pdf; Status: Active; Pin Count: 10 , 5.08mm pitch; Height: *; Lead Free: YES; Cost: 2.46000
TP11-TP14 TP38 TP41-TP47 = Socket: LatestRevisionDate: 17-Jul-2002; LatestRevisionNote: Re-released for DXP Platform.; Publisher: Altium Limited
U8 = TXB0106: TXB0106 - Bidriectional Opendrain/pushpull level shift

## Sheet MZ.SchDoc
size A
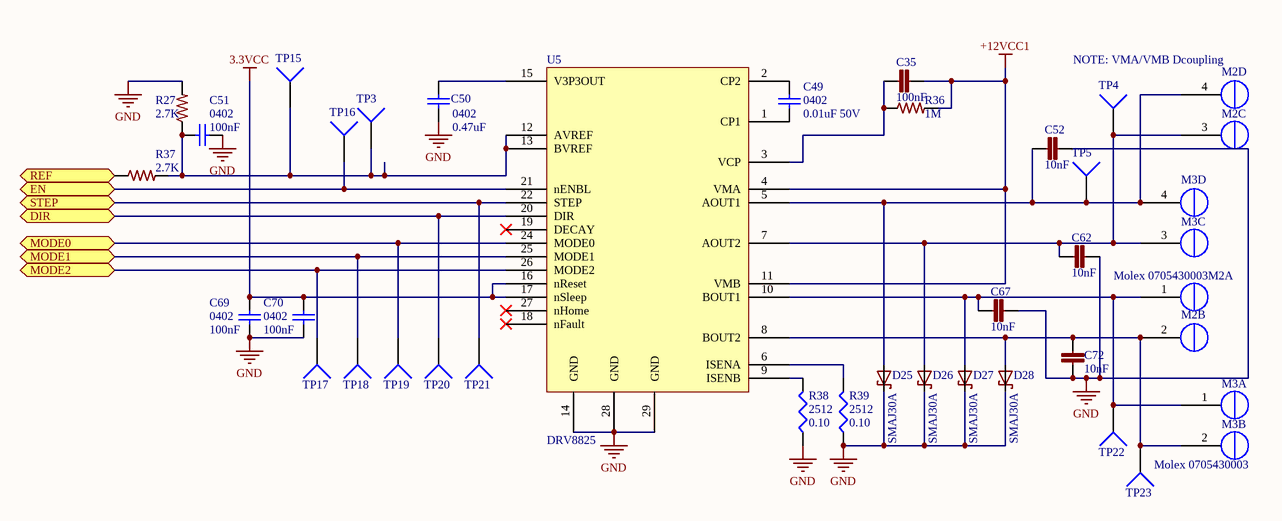
[diagram p7: MZ.SchDoc]

### Parts
C35  100nF  [C0603]
C49  value 0.01uF 50V  [C0402]  (hidden comment: 0402)
C50  value 0.47uF  [C0402]  (hidden comment: 0402)
C51  value 100nF  [C0402]  (hidden comment: 0402)
C52  10nF  [C0603]
C62  10nF  [C0603]
C67  10nF  [C0603]
C69  value 100nF  [C0402]  (hidden comment: 0402)
C70  value 100nF  [C0402]  (hidden comment: 0402)
C72  10nF  [C0603]
D25  SMAJ30A  [SMA-SM]
D26  SMAJ30A  [SMA-SM]
D27  SMAJ30A  [SMA-SM]
D28  SMAJ30A  [SMA-SM]
M2  Molex 0705430003  [4POL254]  (parts A,B,C,D of 4)
M3  Molex 0705430003  [4POL254]  (parts A,B,C,D of 4)
R27  2.7K  [R0402]
R36  1M  [R0402]
R37  2.7K  [R0402]
R38  2512  value 0.10  [2512R-0.55]
R39  2512  value 0.10  [2512R-0.55]
TP3  TP4  [TP-2]  (value not drawn)
TP4  TP4  [TP-2]  (value not drawn)
TP5  TP4  [TP-2]  (value not drawn)
TP15  TP4  [TP-2]  (value not drawn)
TP16  TP4  [TP-2]  (value not drawn)
TP17  TP4  [TP-2]  (value not drawn)
TP18  TP4  [TP-2]  (value not drawn)
TP19  TP4  [TP-2]  (value not drawn)
TP20  TP4  [TP-2]  (value not drawn)
TP21  TP4  [TP-2]  (value not drawn)
TP22  TP4  [TP-2]  (value not drawn)
TP23  TP4  [TP-2]  (value not drawn)
U5  DRV8825  [DRV8825PWPR]

### Ports
DIR, EN, MODE0, MODE1, MODE2, REF, STEP

### Nets
3.3VCC: C69.2 C70.2 U5.16(nReset) U5.17(nSleep)
+12VCC1: C35.2 R36.2 U5.4(VMA) U5.11(VMB)
GND: C50.1 C51.1 C52.2 C62.2 C67.2 C69.1 C70.1 C72.1 D25.C D26.C D27.C D28.C R27.2 R38.1 R39.1 U5.14(GND) U5.28(GND) U5.29(GND)
DIR_Z: TP20.1 U5.20(DIR) ; port DIR
EN_Z: TP16.1 U5.21(nENBL) ; port EN
MOD0E_Z: TP19.1 U5.24(MODE0) ; port MODE0
MOD1E_Z: TP18.1 U5.25(MODE1) ; port MODE1
MOD2E_Z: TP17.1 U5.26(MODE2) ; port MODE2
REF_Z: R37.1 ; port REF
STEP_Z: TP21.1 U5.22(STEP) ; port STEP
NetC35_1: C35.1 R36.1 U5.3(VCP)
NetC49_1: C49.1 U5.1(CP1)
NetC49_2: C49.2 U5.2(CP2)
NetC50_2: C50.2 U5.15(V3P3OUT)
NetC51_2: C51.2 R27.1 R37.2 TP3.1 TP15.1 U5.12(AVREF) U5.13(BVREF)
NetC52_1: C52.1 D25.A M2.4(OUT1B) M3.4(OUT1B) TP5.1 U5.5(AOUT1)
NetC62_1: C62.1 D26.A M2.3(OUT1A) M3.3(OUT1A) TP4.1 U5.7(AOUT2)
NetC67_1: C67.1 D27.A M2.1(OUT2B) M3.1(OUT2B) TP22.1 U5.10(BOUT1)
NetC72_2: C72.2 D28.A M2.2(OUT2A) M3.2(OUT2A) TP23.1 U5.8(BOUT2)
NetR38_2: R38.2 U5.9(ISENB)
NetR39_2: R39.2 U5.6(ISENA)

Not connected (* = marked no-connect by the designer): U5 18(nFault)* 19(DECAY)* 23(NC) 27(nHome)*

### Notes on the sheet
- NOTE: VMA/VMB Dcoupling

### Library data of the parts
C35 = C0603C104K5RACTU: as C11 on sheet Power; Published: 23-Apr-2014; Publisher: UltiMachine; LastRevisionDate: 23-Apr-2014; ManufacturerPartNumber: C0603C104K5RACTU; VALUE: 100nF
C49 = GRM155R71H103JA88D: as C68 on sheet M; Published: 10 - Dec - 2014; LatestRevisionDate: 10 - Dec - 2014; LatestRevisionNote: Ultimachine Footprint Added; Publisher: Ultimachine; Component Type: Chip Capacitor; MFR Part #: GRM155R71H103JA88D; Part Description: CAP CER 10000PF 50V X7R 0402; Mounting Type: SMT 0402; Datasheet: http://search.murata.co.jp/Ceramy/image/img/A01X/G101/ENG/GRM155R71H103JA88-01.pdf; Height: 0.5 ±0.05mm; Digikey #: 490-7763-1-ND; PackageReference: 0402
C50 = GRM155R60J474KE19D: as C24 on sheet ATSAM3X8E Main Controller - TR R1.1; Published: 10 - Dec - 2014; LatestRevisionDate: 10 - Dec - 2014; LatestRevisionNote: Ultimachine Footprint Added; Publisher: Ultimachine; Component Type: Chip Capacitor; MFR Part #: GRM155R60J474KE19D; Mounting Type: SMT 0402; Datasheet: http://search.murata.co.jp/Ceramy/image/img/A01X/G101/ENG/GRM155R60J474KE19-01.pdf; Height: 0.5 ±0.05mm; PackageReference: 0402
C51 C69 C70 = 100nF C0402 - GRM155R71C104KA88D: as C63 on sheet ATSAM3X8E Main Controller - TR R1.1; Published: 10 - Dec - 2014; LatestRevisionDate: 10 - Dec - 2014; LatestRevisionNote: Ultimachine Footprint Added; Publisher: Ultimachine; Component Type: Chip Capacitor; MFR Part #: GRM155R71C104KA88D; Mounting Type: SMT 0402; Datasheet: http://psearch.murata.com/capacitor/product/GRM155R71C104KA88%23.pdf; Height: 0.5 ±0.05mm; PackageReference: 0402
C52 C62 C67 C72 = C1608X7R1E103K080AA: as C3 on sheet M; Published: 23-Apr-2014; Publisher: UltiMachine; LastRevisionDate: 23-Apr-2014; ManufacturerPartNumber: C1608X7R1E103K080AA; VALUE: 10nF
D25-D28 = SMAJ30A: as D20 on sheet M; Published: 23-Apr-2014; Publisher: UltiMachine; LastRevisionDate: 23-Apr-2014; ManufacturerPartNumber: SMAJ30A
M2 M3 = Molex 0705430003 Alt: Molex 4 Pin Clip Connector
R27 R37 = ERJ-2RKF2701X: as R8 on sheet M; Published: 23-Apr-2014; Publisher: Adam; LastRevisionDate: 23-Apr-2014; VALUE: 2.7K
R36 = ERJ2GEJ105X: as R24 on sheet ATSAM3X8E Main Controller - TR R1.1; Published: 23-Apr-2014; Publisher: UltiMachine; LastRevisionDate: 23-Apr-2014; ManufacturerPartNumber: ERJ2GEJ105X; VALUE: 1M
R38 R39 = CSRN2512FTR100: as R32 on sheet M; PackageReference: 2512; MFR #: CSRN2512FTR100; Digikey #: CSRN2512FTR100TR-ND; PDF: http://www.seielect.com/catalog/SEI-CSR_CSRN.pdf
TP3-TP5 TP15-TP23 = Socket: LatestRevisionDate: 17-Jul-2002; LatestRevisionNote: Re-released for DXP Platform.; Publisher: Altium Limited
U5 = DRV8825: as U7 on sheet M; Part Number: DRV8825PWPR; Status: In-Production; Pins: 28 Pins and one Exposed Pad; Datasheet: http://www.ti.com/lit/gpn/drv8825; Height: 1.2mm; Tolerance: N/A; Type: Stepper Driver - Integrated Circuit; Lead Free: YES